# Altium project uSDRt.PrjPcb
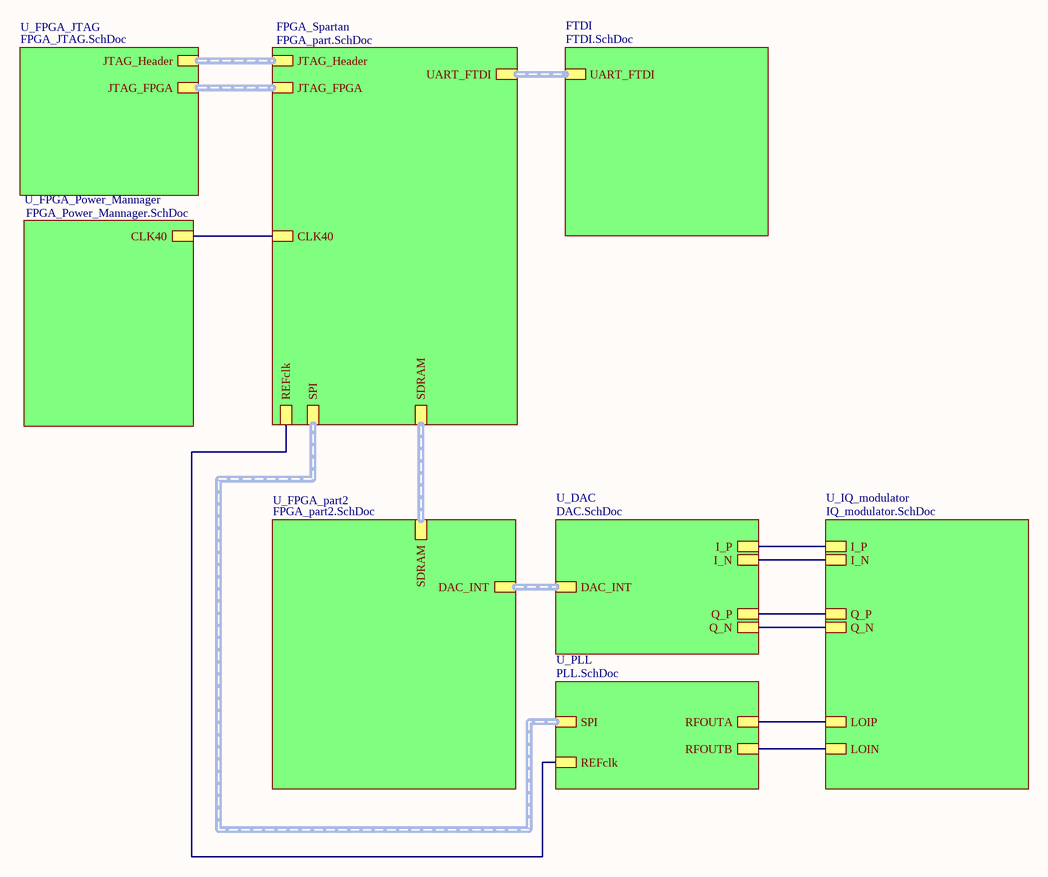
[diagram p0: TOP.SchDoc]
9 sheets, 232 parts. Net scope: hierarchical (ports join the sheet entries above them; power ports are global).
Sheets:
  TOP.SchDoc
    FPGA_Spartan = FPGA_part.SchDoc
    U_FPGA_Power_Mannager = FPGA_Power_Mannager.SchDoc
    U_FPGA_JTAG = FPGA_JTAG.SchDoc
    FTDI = FTDI.SchDoc
    U_FPGA_part2 = FPGA_part2.SchDoc
    U_DAC = DAC.SchDoc
    U_PLL = PLL.SchDoc
    U_IQ_modulator = IQ_modulator.SchDoc

## Sheet TOP.SchDoc
size A4

### Sub-sheets
FPGA_Spartan = FPGA_part.SchDoc: JTAG_FPGA (harness JTAG_FPGA), JTAG_Header (harness JTAG_Header), CLK40, UART_FTDI (harness UART), SDRAM (harness SDRAM), REFclk, SPI (harness SPI)
FTDI = FTDI.SchDoc: UART_FTDI (harness UART)
U_DAC = DAC.SchDoc: DAC_INT (harness DAC), I_P, I_N, Q_P, Q_N
U_FPGA_JTAG = FPGA_JTAG.SchDoc: JTAG_FPGA (harness JTAG_FPGA), JTAG_Header (harness JTAG_Header)
U_FPGA_part2 = FPGA_part2.SchDoc: DAC_INT (harness DAC), SDRAM (harness SDRAM)
U_FPGA_Power_Mannager = FPGA_Power_Mannager.SchDoc: CLK40
U_IQ_modulator = IQ_modulator.SchDoc: Q_N, Q_P, I_N, I_P, LOIP, LOIN
U_PLL = PLL.SchDoc: SPI (harness SPI), REFclk, RFOUTA, RFOUTB

### Nets
DAC_I_N: sheet U_DAC/I_N, sheet U_IQ_modulator/I_N
DAC_I_P: sheet U_DAC/I_P, sheet U_IQ_modulator/I_P
DAC_Q_N: sheet U_DAC/Q_N, sheet U_IQ_modulator/Q_N
DAC_Q_P: sheet U_DAC/Q_P, sheet U_IQ_modulator/Q_P
PLL_N: sheet U_PLL/RFOUTB, sheet U_IQ_modulator/LOIN
PLL_P: sheet U_PLL/RFOUTA, sheet U_IQ_modulator/LOIP
NetC56_1: sheet FPGA_Spartan/REFclk, sheet U_PLL/REFclk
NetR6_2: sheet FPGA_Spartan/CLK40, sheet U_FPGA_Power_Mannager/CLK40

### Buses and harness runs
harness sheet FPGA_Spartan/JTAG_FPGA = sheet U_FPGA_JTAG/JTAG_FPGA
harness sheet FPGA_Spartan/JTAG_Header = sheet U_FPGA_JTAG/JTAG_Header
harness sheet FPGA_Spartan/SDRAM = sheet U_FPGA_part2/SDRAM
harness sheet FPGA_Spartan/SPI = sheet U_PLL/SPI
harness sheet FPGA_Spartan/UART_FTDI = sheet FTDI/UART_FTDI
harness sheet U_DAC/DAC_INT = sheet U_FPGA_part2/DAC_INT

## Sheet FPGA_part.SchDoc
size A4
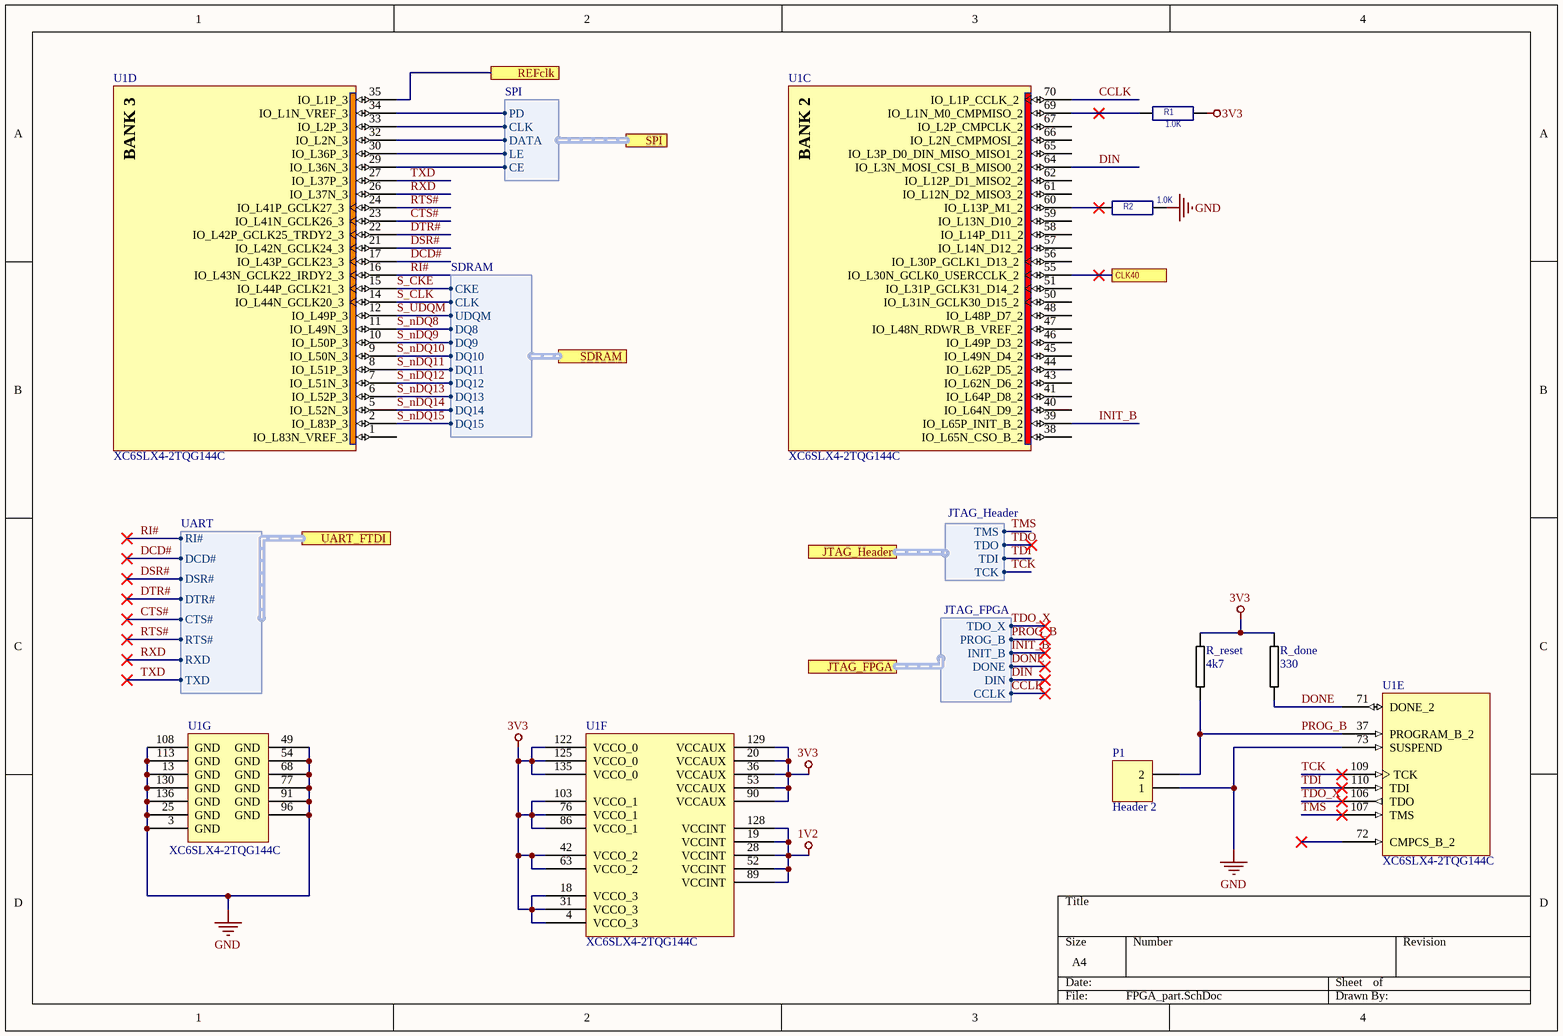
[diagram p1: FPGA_part.SchDoc]

### Parts
P1  Header 2  [HDR1X2]
R1  1.0K  [R0603]
R2  1.0K  [R0603]
R_done  330  [0603R-TBD]
R_reset  4k7  [0603R-TBD]
U1  XC6SLX4-2TQG144C  [TQG144_L]  (parts C,D,E,F,G of 7)

### Ports
CLK40, JTAG_FPGA (harness JTAG_FPGA), JTAG_Header (harness JTAG_Header), REFclk, SDRAM (harness SDRAM), SPI (harness SPI), UART_FTDI (harness UART)

### Harnesses
JTAG_Header: TCK, TDI, TDO, TMS
JTAG_FPGA: CCLK, DIN, DONE, INIT_B, PROG_B, TDO_X
UART: TXD, RXD, RTS#, CTS#, DTR#, DSR#, DCD#, RI#
SDRAM: CKE, CLK, DQ10, DQ11, DQ12, DQ13, DQ14, DQ15, DQ8, DQ9, UDQM
SPI: CE, CLK, DATA, LE, PD

### Nets
1V2: U1.19(VCCINT) U1.28(VCCINT) U1.52(VCCINT) U1.89(VCCINT) U1.128(VCCINT)
3V3: R1.2 R_done.1 R_reset.1 U1.4(VCCO_3) U1.18(VCCO_3) U1.20(VCCAUX) U1.31(VCCO_3) U1.36(VCCAUX) U1.42(VCCO_2) U1.53(VCCAUX) U1.63(VCCO_2) U1.76(VCCO_1) U1.86(VCCO_1) U1.90(VCCAUX) U1.103(VCCO_1) U1.122(VCCO_0) U1.125(VCCO_0) U1.129(VCCAUX) U1.135(VCCO_0)
GND: P1.1 R2.2 U1.3(GND) U1.13(GND) U1.25(GND) U1.49(GND) U1.54(GND) U1.68(GND) U1.73(SUSPEND) U1.77(GND) U1.91(GND) U1.96(GND) U1.108(GND) U1.113(GND) U1.130(GND) U1.136(GND)
CCLK: U1.70(IO_L1P_CCLK_2) ; port JTAG_FPGA.CCLK
CTS#: U1.23(IO_L41N_GCLK26_3) ; port UART_FTDI.CTS#
DCD#: U1.17(IO_L43P_GCLK23_3) ; port UART_FTDI.DCD#
DIN: U1.64(IO_L3N_MOSI_CSI_B_MISO0_2) ; port JTAG_FPGA.DIN
DONE: R_done.2 U1.71(DONE_2) ; port JTAG_FPGA.DONE
DSR#: U1.21(IO_L42N_GCLK24_3) ; port UART_FTDI.DSR#
DTR#: U1.22(IO_L42P_GCLK25_TRDY2_3) ; port UART_FTDI.DTR#
INIT_B: U1.39(IO_L65P_INIT_B_2) ; port JTAG_FPGA.INIT_B
PLL_ce: U1.29(IO_L36N_3) ; port SPI.CE
PLL_clk: U1.33(IO_L2P_3) ; port SPI.CLK
PLL_data: U1.32(IO_L2N_3) ; port SPI.DATA
PLL_le: U1.30(IO_L36P_3) ; port SPI.LE
PLL_pd: U1.34(IO_L1N_VREF_3) ; port SPI.PD
PROG_B: P1.2 R_reset.2 U1.37(PROGRAM_B_2) ; port JTAG_FPGA.PROG_B
RI#: U1.16(IO_L43N_GCLK22_IRDY2_3) ; port UART_FTDI.RI#
RTS#: U1.24(IO_L41P_GCLK27_3) ; port UART_FTDI.RTS#
RXD: U1.26(IO_L37N_3) ; port UART_FTDI.RXD
S_CKE: U1.15(IO_L44P_GCLK21_3) ; port SDRAM.CKE
S_CLK: U1.14(IO_L44N_GCLK20_3) ; port SDRAM.CLK
S_nDQ8: U1.11(IO_L49N_3) ; port SDRAM.DQ8
S_nDQ9: U1.10(IO_L50P_3) ; port SDRAM.DQ9
S_nDQ10: U1.9(IO_L50N_3) ; port SDRAM.DQ10
S_nDQ11: U1.8(IO_L51P_3) ; port SDRAM.DQ11
S_nDQ12: U1.7(IO_L51N_3) ; port SDRAM.DQ12
S_nDQ13: U1.6(IO_L52P_3) ; port SDRAM.DQ13
S_nDQ14: U1.5(IO_L52N_3) ; port SDRAM.DQ14
S_nDQ15: U1.2(IO_L83P_3) ; port SDRAM.DQ15
S_UDQM: U1.12(IO_L49P_3) ; port SDRAM.UDQM
TCK: U1.109(TCK) ; port JTAG_Header.TCK
TDI: U1.110(TDI) ; port JTAG_Header.TDI
TDO_X: U1.106(TDO) ; port JTAG_FPGA.TDO_X
TMS: U1.107(TMS) ; port JTAG_Header.TMS
TXD: U1.27(IO_L37P_3) ; port UART_FTDI.TXD
NetC56_1: U1.35(IO_L1P_3) ; port REFclk
NetR1_1: R1.1 U1.69(IO_L1N_M0_CMPMISO_2)
NetR2_1: R2.1 U1.60(IO_L13P_M1_2)
NetR6_2: U1.55(IO_L30N_GCLK0_USERCCLK_2) ; port CLK40

Not connected (* = marked no-connect by the designer): U1 1(IO_L83N_VREF_3) 38(IO_L65N_CSO_B_2) 40(IO_L64N_D9_2) 41(IO_L64P_D8_2) 43(IO_L62N_D6_2) 44(IO_L62P_D5_2) 45(IO_L49N_D4_2) 46(IO_L49P_D3_2) 47(IO_L48N_RDWR_B_VREF_2) 48(IO_L48P_D7_2) 50(IO_L31N_GCLK30_D15_2) 51(IO_L31P_GCLK31_D14_2) 56(IO_L30P_GCLK1_D13_2) 57(IO_L14N_D12_2) 58(IO_L14P_D11_2) 59(IO_L13N_D10_2) 61(IO_L12N_D2_MISO3_2) 62(IO_L12P_D1_MISO2_2) 65(IO_L3P_D0_DIN_MISO_MISO1_2) 66(IO_L2N_CMPMOSI_2) 67(IO_L2P_CMPCLK_2) 72(CMPCS_B_2)*

### Notes on the sheet
- (in symbol XC6SLX4-2TQG144C, part C) BANK 2
- (in symbol XC6SLX4-2TQG144C, part D) BANK 3

### Library data of the parts
P1 = Header 2: Header, 2-Pin; LatestRevisionDate: 17-Jul-2002; LatestRevisionNote: Re-released for DXP Platform.; Publisher: Altium Limited
R1 R2 = 1.0K_0603_0.063W_5%: 923-3385    RESISTOR MF_0603_1.0KR_0.063W_5%_50V; 232270260102; PHYCOMP; RoHS=Yes
R_done R_reset = 0603R-TBD: RESISTOR 0603 VALUE TO BE DETERMINED
U1 = XC6SLX4-2TQG144C: Spartan-6 LX 1.2V FPGA, 102 User I/Os, 144-Pin TQFP (0.5mm Pitch), Speed Grade 2, Commercial Grade, Pb-Free; Published: 1-Jul-2010; DatasheetVersion: ver1.6, Nov-2010; PackageVersion: ver1.2, Jun-2004; PackageReference: TQG144; Publisher: Altium Limited; PackageDescription: 144-Pin Thin Quad Flat Pack (TQG144) - Pb-Free; Supplier 1: Digi-Key; Supplier Part Number 1: XC6SLX4-2TQG144C-ND; Code_JEDEC: MS-026-BFB; ComponentLink1Description: Manufacturer Link; ComponentLink1URL: http://www.xilinx.com; ComponentLink2Description: Spartan-6 Datasheet; ComponentLink2URL: http://www.xilinx.com/support/documentation/data_sheets/ds160.pdf; ComponentLink3Description: Spartan-6 Documents; ComponentLink3URL: http://www.xilinx.com/support/documentation/spartan-6.htm; ComponentLink4Description: Xilinx.com Home; ComponentLink4URL: http://www.xilinx.com

## Sheet FPGA_Power_Mannager.SchDoc
size A4
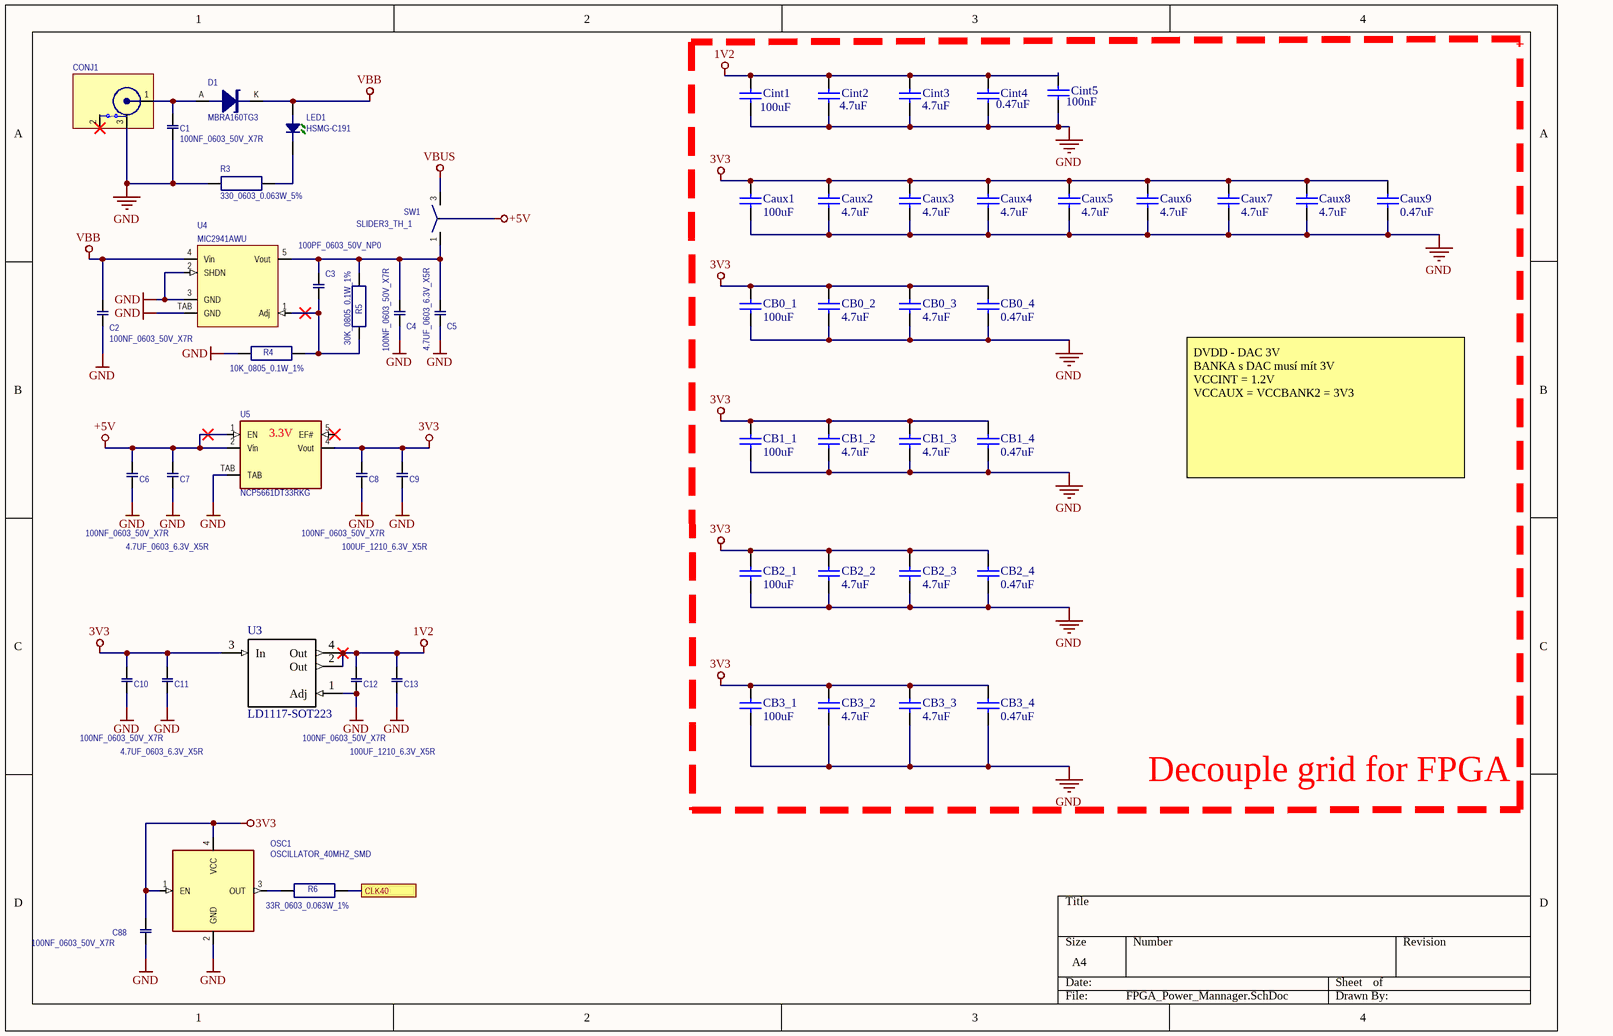
[diagram p2: FPGA_Power_Mannager.SchDoc]

### Parts
C1  100NF_0603_50V_X7R  [CAP0603]
C2  100NF_0603_50V_X7R  [CAP0603]
C3  100PF_0603_50V_NP0  [CAP0603]
C4  100NF_0603_50V_X7R  [CAP0603]
C5  4.7UF_0603_6.3V_X5R  [CAP0603]
C6  100NF_0603_50V_X7R  [CAP0603]
C7  4.7UF_0603_6.3V_X5R  [CAP0603]
C8  100NF_0603_50V_X7R  [CAP0603]
C9  100UF_1210_6.3V_X5R  [CAP1210]
C10  100NF_0603_50V_X7R  [CAP0603]
C11  4.7UF_0603_6.3V_X5R  [CAP0603]
C12  100NF_0603_50V_X7R  [CAP0603]
C13  100UF_1210_6.3V_X5R  [CAP1210]
C88  100NF_0603_50V_X7R  [CAP0603]
Caux1  100UF  [C1206]
Caux2  4.7UF  [1608[0603]]
Caux3  4.7UF  [1608[0603]]
Caux4  4.7UF  [1608[0603]]
Caux5  4.7UF  [1608[0603]]
Caux6  4.7UF  [1608[0603]]
Caux7  4.7UF  [1608[0603]]
Caux8  4.7UF  [1608[0603]]
Caux9  value 0.47uF  [1608[0603]]  (hidden comment: 470nF)
CB0_1  100UF  [C1206]
CB0_2  4.7UF  [1608[0603]]
CB0_3  4.7UF  [1608[0603]]
CB0_4  value 0.47uF  [1608[0603]]  (hidden comment: 470nF)
CB1_1  100UF  [C1206]
CB1_2  4.7UF  [1608[0603]]
CB1_3  4.7UF  [1608[0603]]
CB1_4  value 0.47uF  [1608[0603]]  (hidden comment: 470nF)
CB2_1  100UF  [C1206]
CB2_2  4.7UF  [1608[0603]]
CB2_3  4.7UF  [1608[0603]]
CB2_4  value 0.47uF  [1608[0603]]  (hidden comment: 470nF)
CB3_1  100UF  [C1206]
CB3_2  4.7UF  [1608[0603]]
CB3_3  4.7UF  [1608[0603]]
CB3_4  value 0.47uF  [1608[0603]]  (hidden comment: 470nF)
Cint1  100UF  [C1206]
Cint2  4.7UF  [1608[0603]]
Cint3  4.7UF  [1608[0603]]
Cint4  value 0.47uF  [1608[0603]]  (hidden comment: 470nF)
Cint5  100nF  [1608[0603]]
CONJ1  CON_POWER_DC10A_CLIFF  [CON_POWER_DC10A_CLIFF]  (value not drawn)
D1  MBRA160TG3  [SMA_KA]
LED1  HSMG-C191  [D0603]
OSC1  OSCILLATOR_40MHZ_SMD  [CFPS-73]
R3  330_0603_0.063W_5%  [R0603]
R4  10K_0805_0.1W_1%  [R0805]
R5  30K_0805_0.1W_1%  [R0805]
R6  33R_0603_0.063W_1%  [R0603]
SW1  SLIDER3_TH_1  [X3APH-SLIDER]
U3  LD1117-SOT223  [SOT223]
U4  MIC2941AWU  [TO263_5]
U5  NCP5661DT33RKG  [DPAK5]

### Ports
CLK40

### Nets
1V2: C12.1 C13.1 Cint1.2 Cint2.2 Cint3.2 Cint4.2 Cint5.2 U3.2(Out) U3.4(Out)
3V3: C8.1 C9.1 C10.1 C11.1 C88.2 Caux1.2 Caux2.2 Caux3.2 Caux4.2 Caux5.2 Caux6.2 Caux7.2 Caux8.2 Caux9.2 CB0_1.2 CB0_2.2 CB0_3.2 CB0_4.2 CB1_1.2 CB1_2.2 CB1_3.2 CB1_4.2 CB2_1.2 CB2_2.2 CB2_3.2 CB2_4.2 CB3_1.2 CB3_2.2 CB3_3.2 CB3_4.2 OSC1.1(EN) OSC1.4(VCC) U3.3(In) U5.4(Vout)
+5V: C6.1 C7.1 SW1.2 U5.1(EN) U5.2(Vin)
GND: C1.1 C2.1 C4.2 C5.2 C6.2 C7.2 C8.2 C9.2 C10.2 C11.2 C12.2 C13.2 C88.1 Caux1.1 Caux2.1 Caux3.1 Caux4.1 Caux5.1 Caux6.1 Caux7.1 Caux8.1 Caux9.1 CB0_1.1 CB0_2.1 CB0_3.1 CB0_4.1 CB1_1.1 CB1_2.1 CB1_3.1 CB1_4.1 CB2_1.1 CB2_2.1 CB2_3.1 CB2_4.1 CB3_1.1 CB3_2.1 CB3_3.1 CB3_4.1 Cint1.1 Cint2.1 Cint3.1 Cint4.1 Cint5.1 CONJ1.3 OSC1.2(GND) R3.1 R4.1 U3.1(Adj) U4.2(SHDN) U4.3(GND) U4.TAB(GND) U5.TAB
VBB: C2.2 D1.K(CATHODE) LED1.A U4.4(Vin)
VBUS: SW1.3
NetC1_2: C1.2 CONJ1.1 D1.A(ANODE)
NetC3_1: C3.1 R4.2 R5.2 U4.1(Adj)
NetC3_2: C3.2 C4.1 C5.1 R5.1 SW1.1 U4.5(Vout)
NetLED1_K: LED1.K R3.2
NetOSC1_3: OSC1.3(OUT) R6.1
NetR6_2: R6.2 ; port CLK40

Not connected (* = marked no-connect by the designer): CONJ1 2*; U5 5(EF#)*

### Notes on the sheet
- DVDD - DAC 3V
  BANKA s DAC musí mít 3V
  VCCINT = 1.2V
  VCCAUX = VCCBANK2 = 3V3
- Decouple grid for FPGA
- (in symbol NCP5661DT33RKG) 3.3V

### Library data of the parts
C1 C2 C4 C6 C8 C10 C12 C88 = 100NF_0603_50V_X7R: 128-8255    Capacitor MLC-X7R_0603_100NF_10%_50V; C0603C104K5RAC; KEMET; RoHS=Yes
C3 = 100PF_0603_50V_NP0: 141-4603    Capacitor MLC-NPO_0603_100PF_5%_50V; C0603C101J5GAC; KEMET; RoHS=Yes
C5 C7 C11 = 4.7UF_0603_6.3V_X5R: 940-2110    Capacitor MLC-X5R_0603_4.7uF_10%_6.3V; 225520613672; PHYCOMP; RoHS=Yes
C9 C13 = 100UF_1210_6.3V_X5R: 182-8817    Capacitor CML 100uF_1210_6.3V_X5R_20%; GRM32ER60J107ME20L; MURATA; RoHS=Yes
Caux1-Caux9 CB0_1-CB0_4 CB1_1-CB1_4 CB2_1-CB2_4 CB3_1-CB3_4 Cint1-Cint5 = Cap Semi: Capacitor (Semiconductor SIM Model); Published: 8-Jun-2000; LatestRevisionDate: 29-May-2009; LatestRevisionNote: IPC-7351 Footprint Added.; PackageReference: C1206; Publisher: Altium Limited; PackageDescription: Chip Capacitor
  Caux1 CB0_1 CB1_1 CB2_1 CB3_1 Cint1: Value: 100uF
  Caux2-Caux8 CB0_2 CB0_3 CB1_2 CB1_3 CB2_2 CB2_3 CB3_2 CB3_3 Cint2 Cint3: Value: 4.7uF
  Cint5: Value: 100nF
CONJ1 = CON_POWER_DC10A_CLIFF: 224-959+224-923    (PK10+PK10) SOCKET, PCB, DC POWER, 2.1MM, 5A, 12V; DC10A+DCPP1; CLIFF ELECTRONIC COMPONENTS; RoHS=Yes
D1 = MBRA160TG3: 143-1076    DIODE SCHOTTKY 60V/1A; MBRA160TG3; SMA; ONSEMI; RoHS=Yes; *: *
LED1 = HSMG-C191: 855-4617    LED DIODE GREEN 20mA, 0603; HSMG-C191; AVAGO TECHNOLOGIES; RoHS=Yes
OSC1 = OSCILLATOR_40MHZ_SMD: 522-2564US  CRYSTAL OSCILLATOR, SMD 40MHz/3.3V/50ppm; SPXO018042-CFPS-73; CFPS-73; IQD FREQUENCY PRODUCTS; RoHS=Yes
R3 = 1.0K_0603_0.063W_5%: as R1 on sheet FPGA_part
R4 = 10K_0805_0.1W_1%: 933-2391    RESISTOR MF_0805_10K_0.1W_1%_100V; MC 0.1W 0805 1% 10K; MULTICOMP; RoHS=Yes (repl. for 911-975)
R5 = 30K_0805_0.1W_1%: 933-3002    RESISTOR MF_0805_30K_0.1W_1%_100V; MC 0.1W 0805 1% 30K; MULTICOMP; RoHS=Yes (repl. for 321-8235)
R6 = 33R_0603_0.063W_1%: 933-1050    RESISTOR MF_0603_33R_0.063W_1%_50V; MC_0.063W_0603_1%_33R; MULTICOMP; RoHS=Yes
SW1 = SLIDER3_TH_1: 674-345     SWITCH SLIDE SPDT VERT; 09-03290-01; EAO; RoHS=Yes
U4 = MIC2941AWU: 155-6739    VOLTAGE REGULATOR, ADJ/1,5A, MIC2941AWU; MICREL; RoHS=Yes
U5 = NCP5661DT33RKG: ONSEMI      VOLTAGE REGULATOR NCP5661DT33RKG, LINEAR, LDO, 3.3V/1A, DPAK5; ONSEMI; RoHS=Yes

## Sheet FPGA_JTAG.SchDoc
size A4
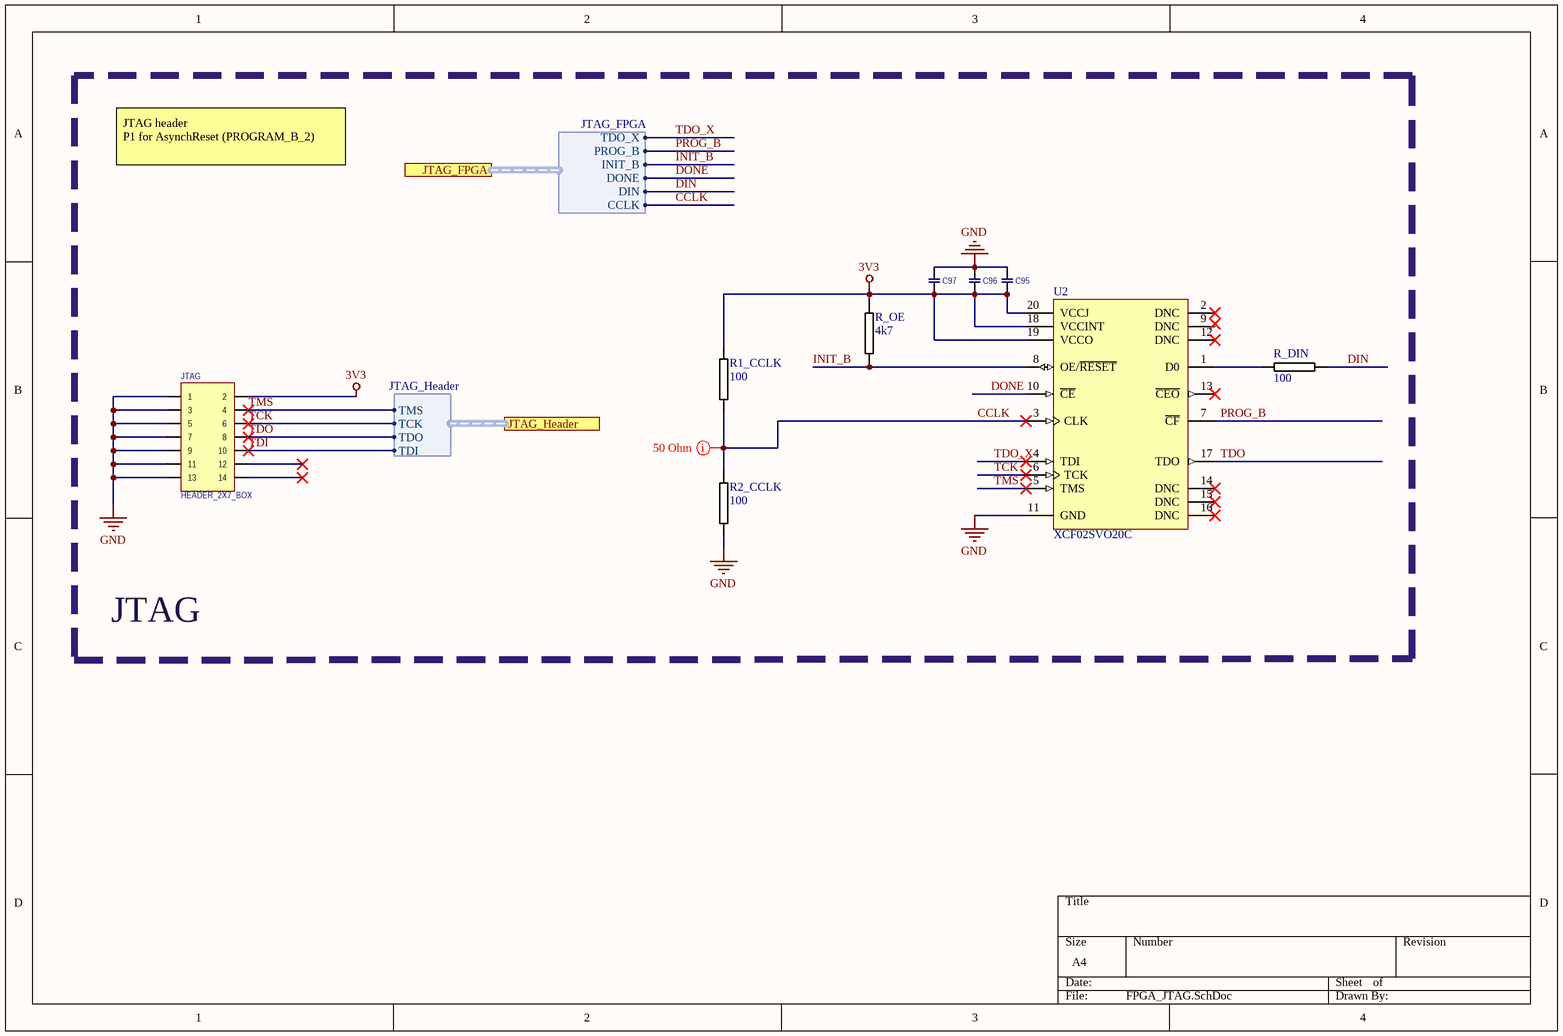
[diagram p3: FPGA_JTAG.SchDoc]

### Parts
C95  100NF_0603_50V_X7R  [CAP0603]  (value not drawn)
C96  470NF_0603_50V_X7R  [CAP0603]  (value not drawn)
C97  1UF_0603_50V_X7R  [CAP0603]  (value not drawn)
JTAG  HEADER_2X7_BOX  [X14ABPB]
R1_CCLK  100  [0603R-TBD]
R2_CCLK  100  [0603R-TBD]
R_DIN  100  [0603R-TBD]
R_OE  4k7  [0603R-TBD]
U2  XCF02SVO20C  [VO20_N]

### Blocks framed on the sheet
JTAG: C95-C97 JTAG R1_CCLK R2_CCLK R_DIN R_OE U2

### Ports
JTAG_FPGA (harness JTAG_FPGA), JTAG_Header (harness JTAG_Header)

### Harnesses
JTAG_FPGA: CCLK, DIN, DONE, INIT_B, PROG_B, TDO_X
JTAG_Header: TCK, TDI, TDO, TMS

### Nets
3V3: C95.2 C96.2 C97.2 JTAG.2 R1_CCLK.1 R_OE.1 U2.18(VCCINT) U2.19(VCCO) U2.20(VCCJ)
GND: C95.1 C96.1 C97.1 JTAG.1 JTAG.3 JTAG.5 JTAG.7 JTAG.9 JTAG.11 JTAG.13 R2_CCLK.2 U2.11(GND)
CCLK: R1_CCLK.2 R2_CCLK.1 U2.3(CLK) ; port JTAG_FPGA.CCLK
DIN: R_DIN.2 ; port JTAG_FPGA.DIN
DONE: U2.10(~{CE}) ; port JTAG_FPGA.DONE
INIT_B: R_OE.2 U2.8(OE/~{RESET}) ; port JTAG_FPGA.INIT_B
PROG_B: U2.7(~{CF}) ; port JTAG_FPGA.PROG_B
TCK: JTAG.6 U2.6(TCK) ; port JTAG_Header.TCK
TDI: JTAG.10 ; port JTAG_Header.TDI
TDO: JTAG.8 U2.17(TDO) ; port JTAG_Header.TDO
TDO_X: U2.4(TDI) ; port JTAG_FPGA.TDO_X
TMS: JTAG.4 U2.5(TMS) ; port JTAG_Header.TMS
NetR_DIN_1: R_DIN.1 U2.1(D0)

Not connected (* = marked no-connect by the designer): JTAG 12* 14*; U2 2(DNC)* 9(DNC) 12(DNC)* 13(~{CEO})* 14(DNC)* 15(DNC)* 16(DNC)*

### Layout directives
mark named 50 Ohm: CCLK

### Notes on the sheet
- JTAG header
  P1 for AsynchReset (PROGRAM_B_2)

### Library data of the parts
C95-C97 = 100NF_0603_50V_X7R: as C1 on sheet FPGA_Power_Mannager
JTAG = HEADER_2X7_BOX: 636-344    STRAIGHT HEADER, DOUBLE ROW OF 7 PINS EACH, BOX, GOLD PLATED, 2.54MM PITCH, 1MM HOLE (match 636-046 SOCKET); 008380014000010; ELCO; RoHS=Yes (alt. 381-6266, 109-9256)
R1_CCLK R2_CCLK R_DIN R_OE = 0603R-TBD: RESISTOR 0603 VALUE TO BE DETERMINED
U2 = XCF02SVO20C: XCF00S Series, Platform Flash In-System Programmable Configuration 3.3V PROM, 20-Pin TSOP, 2-Megabit, Commercial Grade; Published: 17-Sep-2003; LatestRevisionDate: 16-Nov-2009; LatestRevisionNote: Updated to datasheet version 2.17, Oct-2009.; DatasheetVersion: ver2.17, Oct-2009; PackageVersion: ver1.3, Dec-2008; PackageReference: VO20; Publisher: Altium Limited; PackageDescription: 20-Pin Thin Shrink Small Outline Package (VO20); Supplier 1: Digi-Key; Supplier Part Number 1: XCF02SVO20C-ND; Code_JEDEC: MO-153-AC; ComponentLink1Description: Platform Flash Datasheet; ComponentLink1URL: http://www.xilinx.com/support/documentation/data_sheets/ds123.pdf; ComponentLink2Description: VO20 Package Drawing; ComponentLink2URL: http://www.xilinx.com/support/documentation/package_specs/vo20.pdf; ComponentLink3Description: Configuration PROM Documents; ComponentLink3URL: http://www.xilinx.com/support/documentation/configuration_proms.htm; ComponentLink4Description: Xilinx.com Home; ComponentLink4URL: http://www.xilinx.com

## Sheet FTDI.SchDoc
size A4
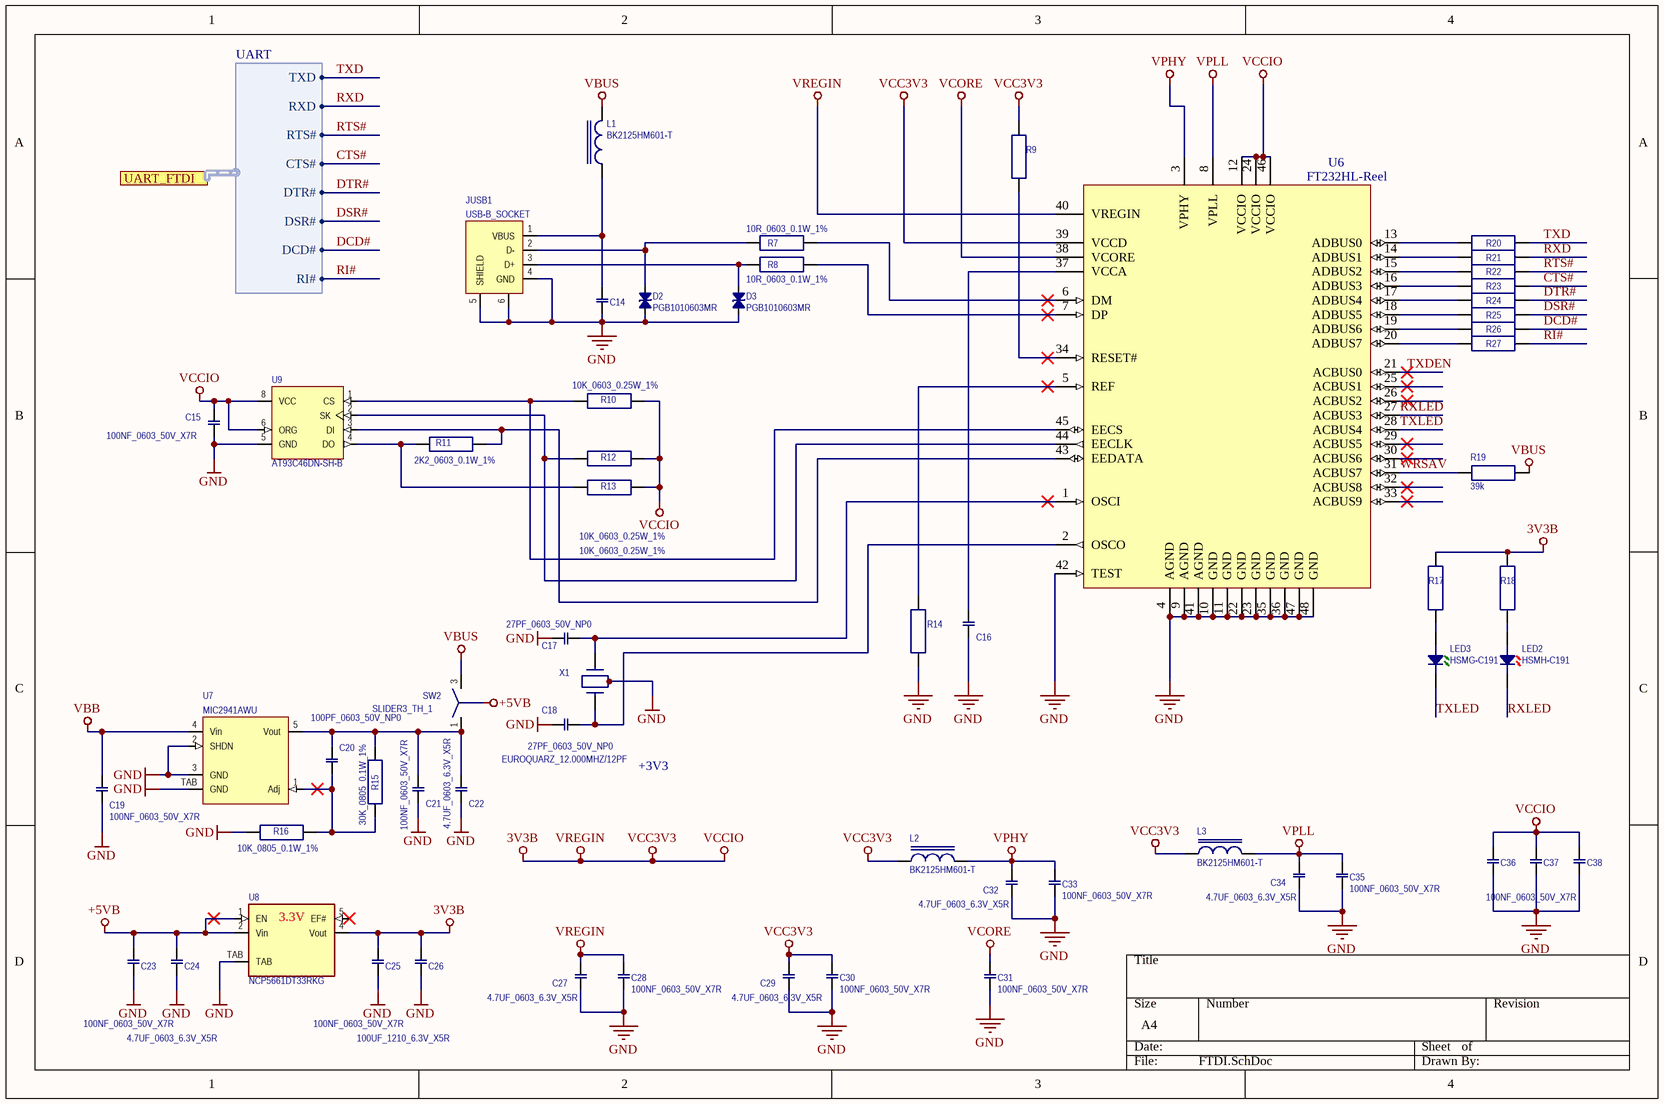
[diagram p4: FTDI.SchDoc]

### Parts
C14  10NF_0603_50V_X7R  [CAP0603]  (value not drawn)
C15  100NF_0603_50V_X7R  [CAP0603]
C16  100NF_0603_50V_X7R  [CAP0603]  (value not drawn)
C17  27PF_0603_50V_NP0  [CAP0603]
C18  27PF_0603_50V_NP0  [CAP0603]
C19  100NF_0603_50V_X7R  [CAP0603]
C20  100PF_0603_50V_NP0  [CAP0603]
C21  100NF_0603_50V_X7R  [CAP0603]
C22  4.7UF_0603_6.3V_X5R  [CAP0603]
C23  100NF_0603_50V_X7R  [CAP0603]
C24  4.7UF_0603_6.3V_X5R  [CAP0603]
C25  100NF_0603_50V_X7R  [CAP0603]
C26  100UF_1210_6.3V_X5R  [CAP1210]
C27  4.7UF_0603_6.3V_X5R  [CAP0603]
C28  100NF_0603_50V_X7R  [CAP0603]
C29  4.7UF_0603_6.3V_X5R  [CAP0603]
C30  100NF_0603_50V_X7R  [CAP0603]
C31  100NF_0603_50V_X7R  [CAP0603]
C32  4.7UF_0603_6.3V_X5R  [CAP0603]
C33  100NF_0603_50V_X7R  [CAP0603]
C34  4.7UF_0603_6.3V_X5R  [CAP0603]
C35  100NF_0603_50V_X7R  [CAP0603]
C36  100NF_0603_50V_X7R  [CAP0603]  (value not drawn)
C37  100NF_0603_50V_X7R  [CAP0603]
C38  100NF_0603_50V_X7R  [CAP0603]  (value not drawn)
D2  PGB1010603MR  [0603]
D3  PGB1010603MR  [0603]
JUSB1  USB-B_SOCKET  [USB-B_SOCKET]
L1  BK2125HM601-T  [L0805]
L2  BK2125HM601-T  [L0805]
L3  BK2125HM601-T  [L0805]
LED2  HSMH-C191  [D0603]
LED3  HSMG-C191  [D0603]
R7  10R_0603_0.1W_1%  [R0603]
R8  10R_0603_0.1W_1%  [R0603]
R9  10K_0603_0.25W_1%  [R0603]  (value not drawn)
R10  10K_0603_0.25W_1%  [R0603]
R11  2K2_0603_0.1W_1%  [R0603]
R12  10K_0603_0.25W_1%  [R0603]
R13  10K_0603_0.25W_1%  [R0603]
R14  12K_0603_0.25W_1%  [R0603]  (value not drawn)
R15  30K_0805_0.1W_1%  [R0805]
R16  10K_0805_0.1W_1%  [R0805]
R17  47R_0603_0.1W_1%  [R0603]  (value not drawn)
R18  62R_0603_0.1W_1%  [R0603]  (value not drawn)
R19  39k  [R0603]
R20  100R_0603_0.1W_1%  [R0603]  (value not drawn)
R21  100R_0603_0.1W_1%  [R0603]  (value not drawn)
R22  100R_0603_0.1W_1%  [R0603]  (value not drawn)
R23  100R_0603_0.1W_1%  [R0603]  (value not drawn)
R24  100R_0603_0.1W_1%  [R0603]  (value not drawn)
R25  100R_0603_0.1W_1%  [R0603]  (value not drawn)
R26  100R_0603_0.1W_1%  [R0603]  (value not drawn)
R27  100R_0603_0.1W_1%  [R0603]  (value not drawn)
SW2  SLIDER3_TH_1  [X3APH-SLIDER]
U6  FT232HL-Reel  [LQFP-48_N]
U7  MIC2941AWU  [TO263_5]
U8  NCP5661DT33RKG  [DPAK5]
U9  AT93C46DN-SH-B  [SOIC8]
X1  EUROQUARZ_12.000MHZ/12PF  [EUROQUARZ_3.2X5.0MM]

### Ports
UART_FTDI (harness UART)

### Harnesses
UART: TXD, RXD, RTS#, CTS#, DTR#, DSR#, DCD#, RI#

### Nets
3V3B: C15.1 C25.1 C26.1 C27.1 C28.1 C29.1 C30.1 C36.1 C37.1 C38.1 L2.1 L3.1 R9.2 R10.2 R12.2 R13.2 R17.2 R18.2 U6.12(VCCIO) U6.24(VCCIO) U6.39(VCCD) U6.40(VREGIN) U6.46(VCCIO) U8.4(Vout) U9.6(ORG) U9.8(VCC)  [also labelled VCC3V3, VCCIO, VREGIN]  [project net Vvco]
+5VB: C23.1 C24.1 SW2.2 U8.1(EN) U8.2(Vin)
GND: C14.2 C15.2 C16.2 C17.2 C18.2 C19.1 C21.2 C22.2 C23.2 C24.2 C25.2 C26.2 C27.2 C28.2 C29.2 C30.2 C31.2 C32.2 C33.2 C34.2 C35.2 C36.2 C37.2 C38.2 D2.1 D3.1 JUSB1.4(GND) JUSB1.5(SHIELD) JUSB1.6(SHIELD) R14.1 R16.1 U6.4(AGND) U6.9(AGND) U6.10(GND) U6.11(GND) U6.22(GND) U6.23(GND) U6.35(GND) U6.36(GND) U6.41(AGND) U6.42(TEST) U6.47(GND) U6.48(GND) U7.2(SHDN) U7.3(GND) U7.TAB(GND) U8.TAB U9.5(GND) X1.2 X1.4  [also labelled SHIELD]
VBB: C19.2 U7.4(Vin)
VBUS: L1.2 R19.2 SW2.3
VCORE: C31.1 U6.38(VCORE)
VPHY: C32.1 C33.1 L2.2 U6.3(VPHY)
VPLL: C34.1 C35.1 L3.2 U6.8(VPLL)
CTS#: R23.2 ; port UART_FTDI.CTS#
DCD#: R26.2 ; port UART_FTDI.DCD#
DSR#: R25.2 ; port UART_FTDI.DSR#
DTR#: R24.2 ; port UART_FTDI.DTR#
RI#: R27.2 ; port UART_FTDI.RI#
RTS#: R22.2 ; port UART_FTDI.RTS#
RXD: R21.2 ; port UART_FTDI.RXD
RXLED: LED2.K U6.27(ACBUS3)
TXD: R20.2 ; port UART_FTDI.TXD
TXDEN: U6.21(ACBUS0)
TXLED: LED3.K U6.28(ACBUS4)
WRSAV: R19.1 U6.31(ACBUS7)
NetC14_1: C14.1 JUSB1.1(VBUS) L1.1
NetC16_1: C16.1 U6.37(VCCA)
NetC17_1: C17.1 U6.1(OSCI) X1.3
NetC18_1: C18.1 U6.2(OSCO) X1.1
NetC20_1: C20.1 R15.2 R16.2 U7.1(Adj)
NetC20_2: C20.2 C21.1 C22.1 R15.1 SW2.1 U7.5(Vout)
NetD2_2: D2.2 JUSB1.2(D-) R7.1
NetD3_2: D3.2 JUSB1.3(D+) R8.1
NetLED2_A: LED2.A R18.1
NetLED3_A: LED3.A R17.1
NetR7_2: R7.2 U6.6(DM)
NetR8_2: R8.2 U6.7(DP)
NetR9_1: R9.1 U6.34(RESET#)
NetR10_1: R10.1 U6.45(EECS) U9.1(CS)
NetR11_1: R11.1 R13.1 U9.4(DO)
NetR11_2: R11.2 U6.43(EEDATA) U9.3(DI)
NetR12_1: R12.1 U6.44(EECLK) U9.2(SK)
NetR14_2: R14.2 U6.5(REF)
NetR20_1: R20.1 U6.13(ADBUS0)
NetR21_1: R21.1 U6.14(ADBUS1)
NetR22_1: R22.1 U6.15(ADBUS2)
NetR23_1: R23.1 U6.16(ADBUS3)
NetR24_1: R24.1 U6.17(ADBUS4)
NetR25_1: R25.1 U6.18(ADBUS5)
NetR26_1: R26.1 U6.19(ADBUS6)
NetR27_1: R27.1 U6.20(ADBUS7)

Not connected (* = marked no-connect by the designer): U6 25(ACBUS1)* 26(ACBUS2)* 29(ACBUS5)* 30(ACBUS6)* 32(ACBUS8)* 33(ACBUS9)*; U8 5(EF#)*

### Notes on the sheet
- +3V3
- (in symbol NCP5661DT33RKG) 3.3V

### Library data of the parts
C14-C16 C19 C21 C23 C25 C28 C30 C31 C33 C35-C38 = 100NF_0603_50V_X7R: as C1 on sheet FPGA_Power_Mannager
C17 C18 = 27PF_0603_50V_NP0: 141-4627    Capacitor MLC-NPO_0603_27PF_5%_50V; C0603C270J5GAC; KEMET; RoHS=Yes
C20 = 100PF_0603_50V_NP0: as C3 on sheet FPGA_Power_Mannager
C22 C24 C27 C29 C32 C34 = 4.7UF_0603_6.3V_X5R: as C5 on sheet FPGA_Power_Mannager
C26 = 100UF_1210_6.3V_X5R: as C9 on sheet FPGA_Power_Mannager
D2 D3 = PGB1010603MR: 175-7240   SUPPRESSOR, ESD, 15KV; PGB1010603MR; LITTELFUSE; RoHS=Yes
JUSB1 = USB-B_SOCKET: 117-7885    USB PANEL SOCKET PCB TYPE B; 2411 02; LUMBERG; RoHS=Yes
L1-L3 = BK2125HM601-T: 161-1995    FERRITE CHIP BEAD 500mA, 600Ohm@100MHz; BK2125HM601-T; TAIYO YUDEN; RoHS=Yes
LED2 = HSMH-C191: 855-4650    LED DIODE RED 25mA, 0603; HSMH-C191; AVAGO TECHNOLOGIES; RoHS=Yes
LED3 = HSMG-C191: as LED1 on sheet FPGA_Power_Mannager
R7 R8 R17 R18 = 10R_0603_0.1W_1%: 146-9751    RESISTOR MF_0603_10R_0.1W_1%_75V; CRCW060310R0FKEA; VISHAY; RoHS=Yes
R9 R10 R12 R13 = 10K_0603_0.25W_1%: 173-8918    RESISTOR MF_0603_10K_0.25W_1%; CRCW06010K0FKEAHP VISHAY; RoHS=Yes
R11 = 2K2_0603_0.1W_1%: 146-9765    RESISTOR MF_0603_2K2_0.1W_1%_75V; CRCW06032K20FKEA; VISHAY; RoHS=Yes
R14 = 12K_0603_0.25W_1%: 173-8919    RESISTOR MF_0603_12KR_0.25W_1%_75V; MC 0.250W 0603 1% 12K; CRCW060312K0FKEAHP VISHAY; RoHS=Yes
R15 = 30K_0805_0.1W_1%: as R5 on sheet FPGA_Power_Mannager
R16 = 10K_0805_0.1W_1%: as R4 on sheet FPGA_Power_Mannager
R19 = 0.0R_0603_0.063W_5%: 923-3130    RESISTOR MF_0603_0.0R_0.1W_50V; RC0603JR-070RL; YAGEO; RoHS=Yes
R20-R27 = 100R_0603_0.1W_1%: 146-9752    RESISTOR MF_0603_100R_0.1W_1%_75V; CRCW0603100RFKEA; VISHAY; RoHS=Yes
SW2 = SLIDER3_TH_1: as SW1 on sheet FPGA_Power_Mannager
U6 = FT232HL-Reel: Single Channel Hi-Speed USB to Multipurpose UART/FIFO IC, 48-pin LQFP, Tape and Reel; Manufacturer: FTDI; DatasheetVersion: ver 1.8, Dec-2012; PackageVersion: Dec-12; PackageReference: LQFP-48; PackageDescription: 48-Pin Thin Quad Flat Pack, 7 x 7 mm Body, 0.5 mm Pitch; PartNumber: FT232HL-Reel; ComponentLink1Description: Manufacturer URL; ComponentLink1URL: http://www.ftdichip.com/; ComponentLink2Description: Datasheet; ComponentLink2URL: http://www.ftdichip.com/Support/Documents/DataSheets/ICs/DS_FT232H.pdf
U7 = MIC2941AWU: as U4 on sheet FPGA_Power_Mannager
U8 = NCP5661DT33RKG: as U5 on sheet FPGA_Power_Mannager
U9 = AT93C46DN-SH-B: 145-5086    EEPROM 1kBit; AT93C46DN-SH-B; SOIC8; ATMEL; RoHS=Yes
X1 = EUROQUARZ_12.000MHZ/12PF: 164-0927    CRYSTAL, SMD, 12.000MHZ MJ/30/30/40/12PF; EUROQUARZ RoHS=Yes

## Sheet FPGA_part2.SchDoc
size A4
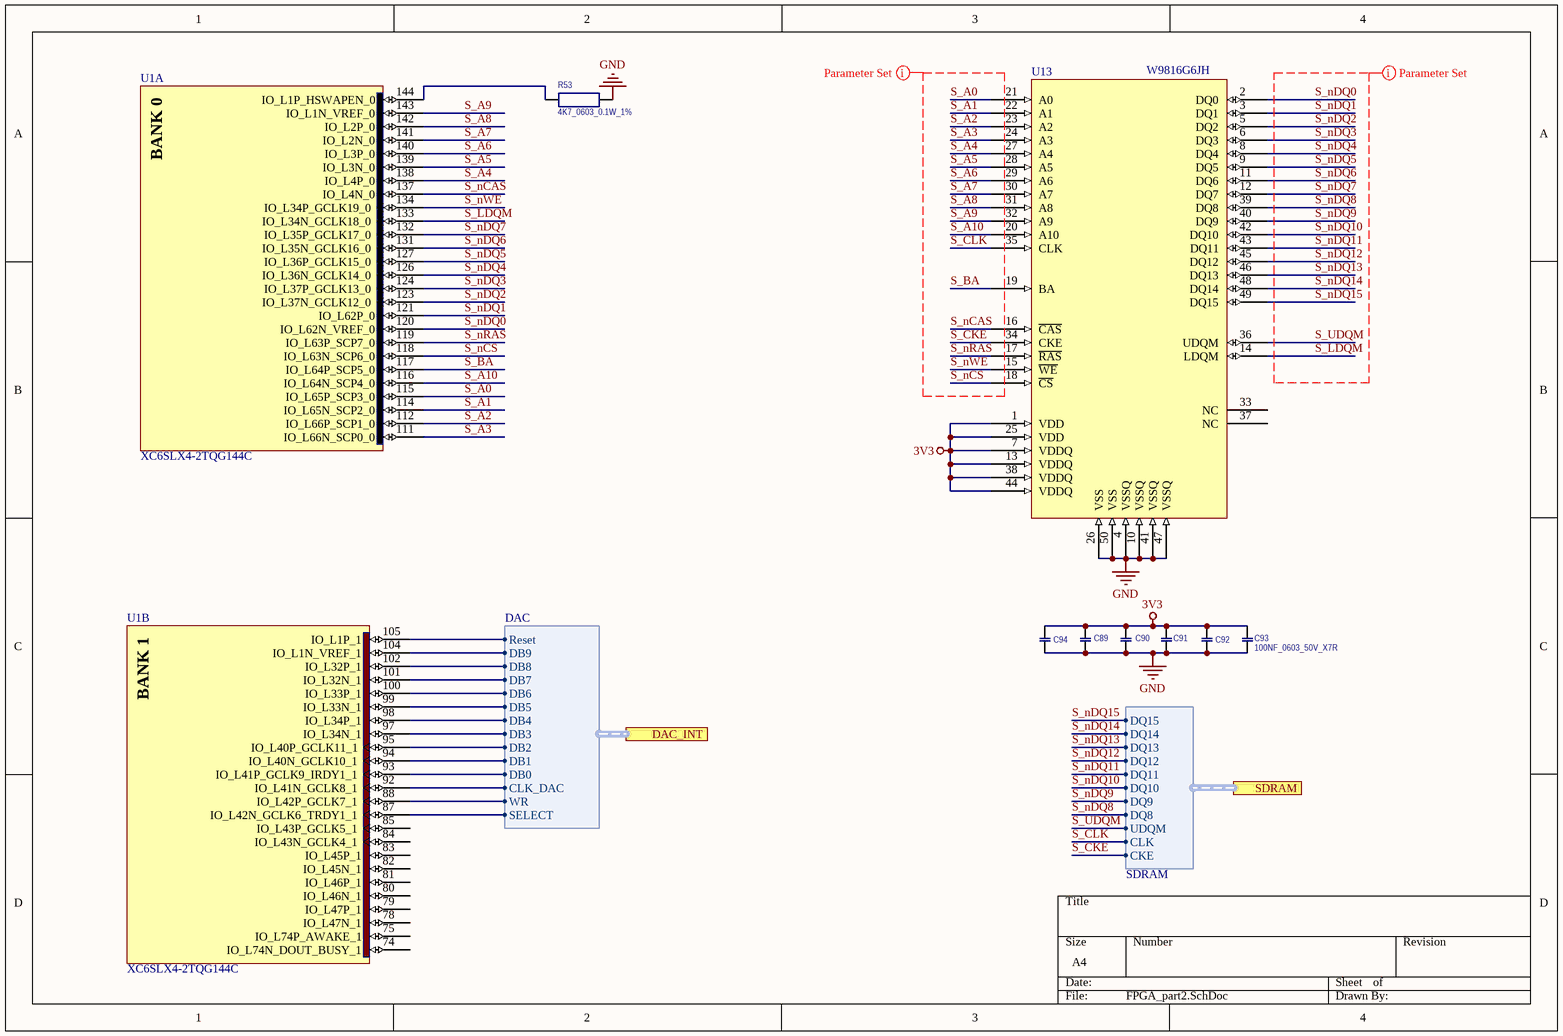
[diagram p5: FPGA_part2.SchDoc]

### Parts
C89  100NF_0603_50V_X7R  [CAP0603]  (value not drawn)
C90  100NF_0603_50V_X7R  [CAP0603]  (value not drawn)
C91  100NF_0603_50V_X7R  [CAP0603]  (value not drawn)
C92  100NF_0603_50V_X7R  [CAP0603]  (value not drawn)
C93  100NF_0603_50V_X7R  [CAP0603]
C94  100NF_0603_50V_X7R  [CAP0603]  (value not drawn)
R53  4K7_0603_0.1W_1%  [R0603]
U1  XC6SLX4-2TQG144C  [TQG144_L]  (parts A,B of 7)
U13  W9816G6JH  [SSOP50]

### Ports
DAC_INT (harness DAC), SDRAM (harness SDRAM)

### Harnesses
DAC: CLK_DAC, DB0, DB1, DB2, DB3, DB4, DB5, DB6, DB7, DB8, DB9, Reset, SELECT, WR
SDRAM: DQ15, DQ8, DQ9, DQ10, DQ11, DQ12, DQ13, DQ14, UDQM, CLK, CKE

### Nets
3V3: C89.1 C90.1 C91.1 C92.1 C93.1 C94.1 U13.1(VDD) U13.7(VDDQ) U13.13(VDDQ) U13.25(VDD) U13.38(VDDQ) U13.44(VDDQ)
GND: C89.2 C90.2 C91.2 C92.2 C93.2 C94.2 R53.2 U13.4(VSSQ) U13.10(VSSQ) U13.26(VSS) U13.41(VSSQ) U13.47(VSSQ) U13.50(VSS)
CLK_DAC: U1.92(IO_L41N_GCLK8_1) ; port DAC_INT.CLK_DAC
DB0: U1.93(IO_L41P_GCLK9_IRDY1_1) ; port DAC_INT.DB0
DB1: U1.94(IO_L40N_GCLK10_1) ; port DAC_INT.DB1
DB2: U1.95(IO_L40P_GCLK11_1) ; port DAC_INT.DB2
DB3: U1.97(IO_L34N_1) ; port DAC_INT.DB3
DB4: U1.98(IO_L34P_1) ; port DAC_INT.DB4
DB5: U1.99(IO_L33N_1) ; port DAC_INT.DB5
DB6: U1.100(IO_L33P_1) ; port DAC_INT.DB6
DB7: U1.101(IO_L32N_1) ; port DAC_INT.DB7
DB8: U1.102(IO_L32P_1) ; port DAC_INT.DB8
DB9: U1.104(IO_L1N_VREF_1) ; port DAC_INT.DB9
Reset/Sleep: U1.105(IO_L1P_1) ; port DAC_INT.Reset
S_A0: U1.115(IO_L65P_SCP3_0) U13.21(A0)
S_A1: U1.114(IO_L65N_SCP2_0) U13.22(A1)
S_A2: U1.112(IO_L66P_SCP1_0) U13.23(A2)
S_A3: U1.111(IO_L66N_SCP0_0) U13.24(A3)
S_A4: U1.138(IO_L4P_0) U13.27(A4)
S_A5: U1.139(IO_L3N_0) U13.28(A5)
S_A6: U1.140(IO_L3P_0) U13.29(A6)
S_A7: U1.141(IO_L2N_0) U13.30(A7)
S_A8: U1.142(IO_L2P_0) U13.31(A8)
S_A9: U1.143(IO_L1N_VREF_0) U13.32(A9)
S_A10: U1.116(IO_L64N_SCP4_0) U13.20(A10)
S_BA: U1.117(IO_L64P_SCP5_0) U13.19(BA)
S_CKE: U13.34(CKE) ; port SDRAM.CKE
S_CLK: U13.35(CLK) ; port SDRAM.CLK
S_LDQM: U1.133(IO_L34N_GCLK18_0) U13.14(LDQM)
S_nCAS: U1.137(IO_L4N_0) U13.16(~{CAS})
S_nCS: U1.118(IO_L63N_SCP6_0) U13.18(~{CS})
S_nDQ0: U1.120(IO_L62N_VREF_0) U13.2(DQ0)
S_nDQ1: U1.121(IO_L62P_0) U13.3(DQ1)
S_nDQ2: U1.123(IO_L37N_GCLK12_0) U13.5(DQ2)
S_nDQ3: U1.124(IO_L37P_GCLK13_0) U13.6(DQ3)
S_nDQ4: U1.126(IO_L36N_GCLK14_0) U13.8(DQ4)
S_nDQ5: U1.127(IO_L36P_GCLK15_0) U13.9(DQ5)
S_nDQ6: U1.131(IO_L35N_GCLK16_0) U13.11(DQ6)
S_nDQ7: U1.132(IO_L35P_GCLK17_0) U13.12(DQ7)
S_nDQ8: U13.39(DQ8) ; port SDRAM.DQ8
S_nDQ9: U13.40(DQ9) ; port SDRAM.DQ9
S_nDQ10: U13.42(DQ10) ; port SDRAM.DQ10
S_nDQ11: U13.43(DQ11) ; port SDRAM.DQ11
S_nDQ12: U13.45(DQ12) ; port SDRAM.DQ12
S_nDQ13: U13.46(DQ13) ; port SDRAM.DQ13
S_nDQ14: U13.48(DQ14) ; port SDRAM.DQ14
S_nDQ15: U13.49(DQ15) ; port SDRAM.DQ15
S_nRAS: U1.119(IO_L63P_SCP7_0) U13.17(~{RAS})
S_nWE: U1.134(IO_L34P_GCLK19_0) U13.15(~{WE})
S_UDQM: U13.36(UDQM) ; port SDRAM.UDQM
SELECT: U1.87(IO_L42N_GCLK6_TRDY1_1) ; port DAC_INT.SELECT
WR_DAC: U1.88(IO_L42P_GCLK7_1) ; port DAC_INT.WR
NetR53_1: R53.1 U1.144(IO_L1P_HSWAPEN_0)

Not connected (* = marked no-connect by the designer): U1 74(IO_L74N_DOUT_BUSY_1) 75(IO_L74P_AWAKE_1) 78(IO_L47N_1) 79(IO_L47P_1) 80(IO_L46N_1) 81(IO_L46P_1) 82(IO_L45N_1) 83(IO_L45P_1) 84(IO_L43N_GCLK4_1) 85(IO_L43P_GCLK5_1); U13 33(NC) 37(NC)

### Layout directives
net class SDRAM: S_A0, S_A1, S_A2, S_A3, S_A4, S_A5, S_A6, S_A7, S_A8, S_A9, S_A10, S_BA, S_CKE, S_CLK, S_LDQM, S_nCAS, S_nCS, S_nDQ0, S_nDQ1, S_nDQ2, S_nDQ3, S_nDQ4, S_nDQ5, S_nDQ6, S_nDQ7, S_nDQ8, S_nDQ9, S_nDQ10, S_nDQ11, S_nDQ12, S_nDQ13, S_nDQ14, S_nDQ15, S_nRAS, S_nWE, S_UDQM

### Notes on the sheet
- (in symbol XC6SLX4-2TQG144C, part A) BANK 0
- (in symbol XC6SLX4-2TQG144C, part B) BANK 1

### Library data of the parts
C89-C94 = 100NF_0603_50V_X7R: as C1 on sheet FPGA_Power_Mannager
R53 = 4K7_0603_0.1W_1%: 146-9807    RESISTOR MF_0603_4K7_0.1W_1%_75V; CRCW06034K70FKEA; VISHAY; RoHS=Yes
U1 = XC6SLX4-2TQG144C: as U1 on sheet FPGA_part; Published: 1-Jul-2010; DatasheetVersion: ver1.6, Nov-2010; PackageVersion: ver1.2, Jun-2004; PackageReference: TQG144; Publisher: Altium Limited; PackageDescription: 144-Pin Thin Quad Flat Pack (TQG144) - Pb-Free; Supplier 1: Digi-Key; Supplier Part Number 1: XC6SLX4-2TQG144C-ND; Code_JEDEC: MS-026-BFB; ComponentLink1Description: Manufacturer Link; ComponentLink1URL: http://www.xilinx.com; ComponentLink2Description: Spartan-6 Datasheet; ComponentLink2URL: http://www.xilinx.com/support/documentation/data_sheets/ds160.pdf; ComponentLink3Description: Spartan-6 Documents; ComponentLink3URL: http://www.xilinx.com/support/documentation/spartan-6.htm; ComponentLink4Description: Xilinx.com Home; ComponentLink4URL: http://www.xilinx.com

## Sheet DAC.SchDoc
size A4
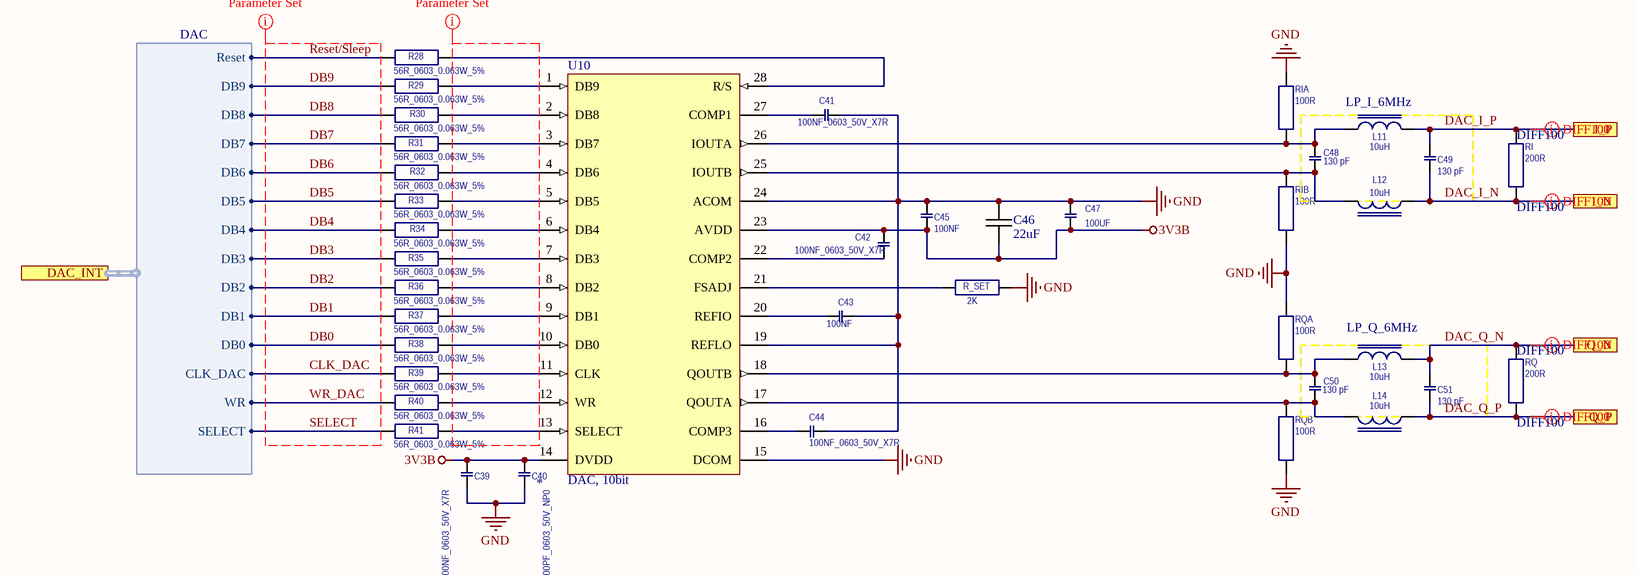
[diagram p6: DAC.SchDoc]

### Parts
C39  100NF_0603_50V_X7R  [CAP0603]
C40  100PF_0603_50V_NP0  [CAP0603]
C41  100NF_0603_50V_X7R  [CAP0603]
C42  100NF_0603_50V_X7R  [CAP0603]
C43  100NF  [CAP0603]
C44  100NF_0603_50V_X7R  [CAP0603]
C45  100NF  [CAP0603]
C46  22uF  [0805C-GENERIC]
C47  100UF  [CAP1210]
C48  130 pF  [CAP0603]
C49  130 pF  [CAP0603]
C50  130 pF  [CAP0603]
C51  130 pF  [CAP0603]
L11  10uH  [L0805]
L12  10uH  [L0805]
L13  10uH  [L0805]
L14  10uH  [L0805]
R28  56R_0603_0.063W_5%  [R0603]
R29  56R_0603_0.063W_5%  [R0603]
R30  56R_0603_0.063W_5%  [R0603]
R31  56R_0603_0.063W_5%  [R0603]
R32  56R_0603_0.063W_5%  [R0603]
R33  56R_0603_0.063W_5%  [R0603]
R34  56R_0603_0.063W_5%  [R0603]
R35  56R_0603_0.063W_5%  [R0603]
R36  56R_0603_0.063W_5%  [R0603]
R37  56R_0603_0.063W_5%  [R0603]
R38  56R_0603_0.063W_5%  [R0603]
R39  56R_0603_0.063W_5%  [R0603]
R40  56R_0603_0.063W_5%  [R0603]
R41  56R_0603_0.063W_5%  [R0603]
R_SET  2K  [R0603]
RI  200R  [R0603]
RIA  100R  [R0603]
RIB  100R  [R0603]
RQ  200R  [R0603]
RQA  100R  [R0603]
RQB  100R  [R0603]
U10  DAC, 10bit  [SSOP28]

### Blocks framed on the sheet
LP_I_6MHz: C48 C49 L11 L12
LP_Q_6MHz: C50 C51 L13 L14

### Ports
DAC_INT (harness DAC), I_N, I_P, Q_N, Q_P

### Harnesses
DAC: DB0, DB1, DB2, DB3, DB4, DB5, DB6, DB7, DB8, DB9, CLK_DAC, WR, SELECT, Reset

### Nets
3V3B: C39.1 C40.1 C42.2 C45.2 C46.2 C47.2 U10.14(DVDD) U10.23(AVDD)  [project net Vvco]
GND: C39.2 C40.2 C41.2 C43.2 C44.1 C45.1 C46.1 C47.1 R_SET.2 RIA.2 RIB.1 RQA.2 RQB.1 U10.15(DCOM) U10.19(REFLO) U10.24(ACOM)
CLK_DAC: R39.1 ; port DAC_INT.CLK_DAC
DAC_I_N: C49.2 L12.1 RI.1 ; port I_N
DAC_I_P: C49.1 L11.2 RI.2 ; port I_P
DAC_Q_N: C51.1 L13.2 RQ.2 ; port Q_N
DAC_Q_P: C51.2 L14.1 RQ.1 ; port Q_P
DB0: R38.1 ; port DAC_INT.DB0
DB1: R37.1 ; port DAC_INT.DB1
DB2: R36.1 ; port DAC_INT.DB2
DB3: R35.1 ; port DAC_INT.DB3
DB4: R34.1 ; port DAC_INT.DB4
DB5: R33.1 ; port DAC_INT.DB5
DB6: R32.1 ; port DAC_INT.DB6
DB7: R31.1 ; port DAC_INT.DB7
DB8: R30.1 ; port DAC_INT.DB8
DB9: R29.1 ; port DAC_INT.DB9
Reset/Sleep: R28.1 ; port DAC_INT.Reset
SELECT: R41.1 ; port DAC_INT.SELECT
WR_DAC: R40.1 ; port DAC_INT.WR
NetC41_1: C41.1 U10.27(COMP1)
NetC42_1: C42.1 U10.22(COMP2)
NetC43_1: C43.1 U10.20(REFIO)
NetC44_2: C44.2 U10.16(COMP3)
NetC48_1: C48.1 L11.1 RIA.1 U10.26(IOUTA)
NetC48_2: C48.2 L12.2 RIB.2 U10.25(IOUTB)
NetC50_1: C50.1 L13.1 RQA.1 U10.18(QOUTB)
NetC50_2: C50.2 L14.2 RQB.2 U10.17(QOUTA)
NetR28_2: R28.2 U10.28(R/S)
NetR29_2: R29.2 U10.1(DB9)
NetR30_2: R30.2 U10.2(DB8)
NetR31_2: R31.2 U10.3(DB7)
NetR32_2: R32.2 U10.4(DB6)
NetR33_2: R33.2 U10.5(DB5)
NetR34_2: R34.2 U10.6(DB4)
NetR35_2: R35.2 U10.7(DB3)
NetR36_2: R36.2 U10.8(DB2)
NetR37_2: R37.2 U10.9(DB1)
NetR38_2: R38.2 U10.10(DB0)
NetR39_2: R39.2 U10.11(CLK)
NetR40_2: R40.2 U10.12(WR)
NetR41_2: R41.2 U10.13(SELECT)
NetR_SET_1: R_SET.1 U10.21(FSADJ)

### Layout directives
net class DAC_BR: CLK_DAC, DB0, DB1, DB2, DB3, DB4, DB5, DB6, DB7, DB8, DB9, Reset/Sleep, SELECT, WR_DAC
net class DAC_AR: (no net found under the mark)
differential pair; net class DIFF100: DAC_I_N, DAC_I_P, DAC_Q_N, DAC_Q_P

### Library data of the parts
C39 C41-C45 C48-C51 = 100NF_0603_50V_X7R: as C1 on sheet FPGA_Power_Mannager
C40 = 100PF_0603_50V_NP0: as C3 on sheet FPGA_Power_Mannager
C46 = 0805C-22UF-6V3-X5R-TDK: CAPACITOR 0805 CERAMIC; Manufacturer: TDK Corporation; Manufacturer Part Number: C2012X5R0J226M; Tolerance: ±20%; Capacitance: 22µF; Temperature Coefficient: X5R; Voltage - Rated: 6.3V; Supplier 1: Digi-Key; Supplier Part Number 1: 445-1422-2-ND; Operating Temperature: -55°C ~ 85°C; Mounting Type: Surface Mount, MLCC; RoHS: RoHS Compliant; Packaging: Tape & Reel (TR); Features: General Purpose; Lead Spacing: -; Category: Capacitors; Thickness: 1.25mm; Package / Case: 0805 (2012 Metric); Supplier Part Number: 445-1422-2-ND; Supplier: Digi-Key
C47 = 100UF_1210_6.3V_X5R: as C9 on sheet FPGA_Power_Mannager
L11-L14 = BK2125HM601-T: as L1 on sheet FTDI
R28-R41 = 0.0R_0603_0.063W_5%: as R19 on sheet FTDI
R_SET = 2K2_0603_0.1W_1%: as R11 on sheet FTDI
RI RQ = 100R_0603_0.1W_1%: as R20 on sheet FTDI
RIA RIB RQA RQB = 1.0K_0603_0.063W_5%: as R1 on sheet FPGA_part
U10 = AD9761: Parameter 1: *

## Sheet PLL.SchDoc
size A4
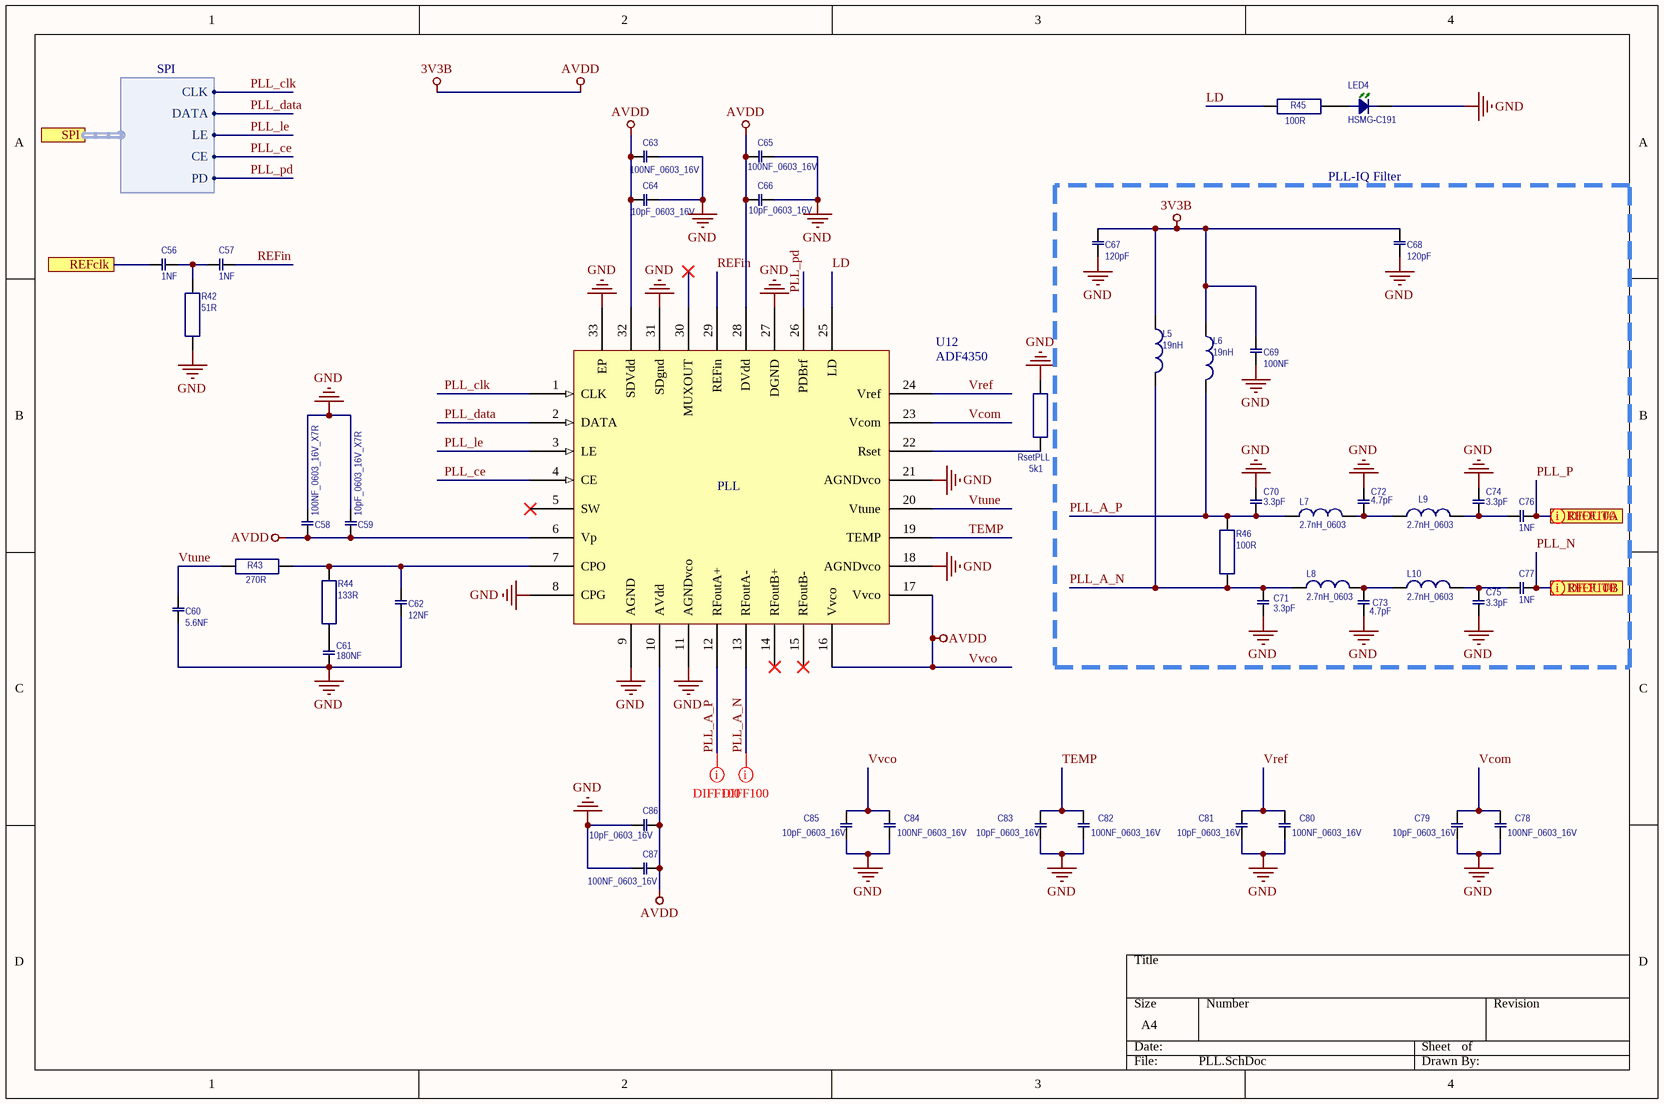
[diagram p7: PLL.SchDoc]

### Parts
C56  1NF  [CAP0603]
C57  1NF  [CAP0603]
C58  100NF_0603_16V_X7R  [CAP0603]
C59  10pF_0603_16V_X7R  [CAP0603]
C60  5.6NF  [CAP0603]
C61  180NF  [CAP0603]
C62  12NF  [CAP0603]
C63  100NF_0603_16V  [CAP0603]
C64  10pF_0603_16V  [CAP0603]
C65  100NF_0603_16V  [CAP0603]
C66  10pF_0603_16V  [CAP0603]
C67  120pF  [CAP0603]
C68  120pF  [CAP0603]
C69  100NF  [CAP0603]
C70  3.3pF  [CAP0603]
C71  3.3pF  [CAP0603]
C72  4.7pF  [CAP0603]
C73  4.7pF  [CAP0603]
C74  3.3pF  [CAP0603]
C75  3.3pF  [CAP0603]
C76  1NF  [CAP0603]
C77  1NF  [CAP0603]
C78  100NF_0603_16V  [CAP0603]
C79  10pF_0603_16V  [CAP0603]
C80  100NF_0603_16V  [CAP0603]
C81  10pF_0603_16V  [CAP0603]
C82  100NF_0603_16V  [CAP0603]
C83  10pF_0603_16V  [CAP0603]
C84  100NF_0603_16V  [CAP0603]
C85  10pF_0603_16V  [CAP0603]
C86  10pF_0603_16V  [CAP0603]
C87  100NF_0603_16V  [CAP0603]
L5  19nH  [0603]
L6  19nH  [0603]
L7  2.7nH_0603  [0603]
L8  2.7nH_0603  [0603]
L9  2.7nH_0603  [0603]
L10  2.7nH_0603  [0603]
LED4  HSMG-C191  [D0603]
R42  51R  [R0603]
R43  270R  [R0603]
R44  133R  [R0603]
R45  100R  [R0603]
R46  100R  [R0603]
RsetPLL  5k1  [R0603]
U12  ADF4350  [LFCSP8]

### Blocks framed on the sheet
PLL-IQ Filter: C67-C77 L5-L10 R46

### Ports
REFclk, RFOUTA, RFOUTB, SPI (harness SPI)

### Harnesses
SPI: CLK, DATA, LE, CE, PD

### Nets
GND: C58.2 C59.2 C60.2 C61.2 C62.2 C63.2 C64.2 C65.2 C66.2 C67.2 C68.2 C69.2 C70.1 C71.2 C72.1 C73.2 C74.1 C75.2 C78.2 C79.2 C80.2 C81.2 C82.2 C83.2 C84.2 C85.2 C86.2 C87.2 LED4.K R42.1 RsetPLL.1 U12.8(CPG) U12.9(AGND) U12.11(AGNDvco) U12.18(AGNDvco) U12.21(AGNDvco) U12.27(DGND) U12.31(SDgnd) U12.33(EP)
Vvco: C58.1 C59.1 C63.1 C64.1 C65.1 C66.1 C67.1 C68.1 C69.1 C84.1 C85.1 C86.1 C87.1 L5.1 L6.1 U12.6(Vp) U12.10(AVdd) U12.16(Vvco) U12.17(Vvco) U12.28(DVdd) U12.32(SDVdd)  [also labelled 3V3B, AVDD]
LD: R45.1 U12.25(LD)
PLL_A_N: C71.1 L5.2 L8.1 R46.1 U12.13(RFoutA-)
PLL_A_P: C70.2 L6.2 L7.1 R46.2 U12.12(RFoutA+)
PLL_ce: U12.4(CE) ; port SPI.CE
PLL_clk: U12.1(CLK) ; port SPI.CLK
PLL_data: U12.2(DATA) ; port SPI.DATA
PLL_le: U12.3(LE) ; port SPI.LE
PLL_N: C77.2 ; port RFOUTB
PLL_P: C76.2 ; port RFOUTA
PLL_pd: U12.26(PDBrf) ; port SPI.PD
REFin: C57.2 U12.29(REFin)
TEMP: C82.1 C83.1 U12.19(TEMP)
Vcom: C78.1 C79.1 U12.23(Vcom)
Vref: C80.1 C81.1 U12.24(Vref)
Vtune: C60.1 R43.2 U12.20(Vtune)
NetC56_1: C56.1 ; port REFclk
NetC56_2: C56.2 C57.1 R42.2
NetC61_1: C61.1 R44.1
NetC62_1: C62.1 R43.1 R44.2 U12.7(CPO)
NetC72_2: C72.2 L7.2 L9.1
NetC73_1: C73.1 L8.2 L10.1
NetC74_2: C74.2 C76.1 L9.2
NetC75_1: C75.1 C77.1 L10.2
NetLED4_A: LED4.A R45.2
NetRsetPLL_2: RsetPLL.2 U12.22(Rset)

Not connected (* = marked no-connect by the designer): U12 5(SW)* 14(RFoutB+)* 15(RFoutB-)* 30(MUXOUT)*

### Layout directives
differential pair; net class DIFF_PLL: PLL_A_N, PLL_A_P, PLL_N, PLL_P

### Notes on the sheet
- (in symbol ADF4150) PLL

### Library data of the parts
C56-C66 C69 C76-C87 = 100NF_0603_50V_X7R: as C1 on sheet FPGA_Power_Mannager
C67 C68 C70-C75 = 100PF_0603_50V_NP0: as C3 on sheet FPGA_Power_Mannager
L5-L10 = Inductor0603
LED4 = HSMG-C191: as LED1 on sheet FPGA_Power_Mannager
R42 = 120R_0603_0.1W_1%: 165-2832    RESISTOR MF_0603_120R_0.1W_1%_75V; CRCW0603120RFKEA; VISHAY; RoHS=Yes
R43 R44 R46 = 100R_0603_0.1W_1%: as R20 on sheet FTDI
R45 = 0.0R_0603_0.063W_5%: as R19 on sheet FTDI
RsetPLL = 4K7_0603_0.1W_1%: as R53 on sheet FPGA_part2
U12 = ADF4150

## Sheet IQ_modulator.SchDoc
size A4
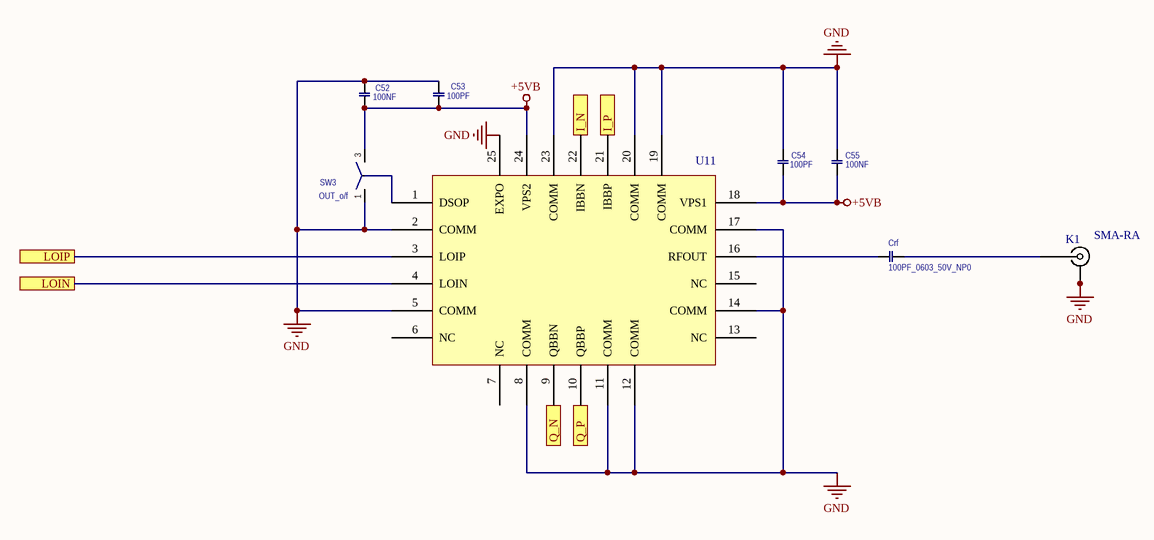
[diagram p8: IQ_modulator.SchDoc]

### Parts
C52  100NF  [CAP0603]
C53  100PF  [CAP0603]
C54  100PF  [CAP0603]
C55  100NF  [CAP0603]
Crf  100PF_0603_50V_NP0  [CAP0603]
K1  SMA-RA  [SMA-RA]
SW3  OUT_o/f  [X3APH-SLIDER]
U11  ADL5375  [LFCSP]  (value not drawn)

### Ports
I_N, I_P, LOIN, LOIP, Q_N, Q_P

### Nets
+5VB: C52.2 C53.2 C54.2 C55.2 SW3.3 U11.18(VPS1) U11.24(VPS2)
GND: C52.1 C53.1 C54.1 C55.1 K1.2 K1.3 K1.4 K1.5 SW3.1 U11.2(COMM) U11.5(COMM) U11.8(COMM) U11.11(COMM) U11.12(COMM) U11.14(COMM) U11.17(COMM) U11.19(COMM) U11.20(COMM) U11.23(COMM) U11.25(EXPO)
DAC_I_N: U11.22(IBBN) ; port I_N
DAC_I_P: U11.21(IBBP) ; port I_P
DAC_Q_N: U11.9(QBBN) ; port Q_N
DAC_Q_P: U11.10(QBBP) ; port Q_P
PLL_N: U11.4(LOIN) ; port LOIN
PLL_P: U11.3(LOIP) ; port LOIP
NetCrf_1: Crf.1 U11.16(RFOUT)
NetCrf_2: Crf.2 K1.1
NetSW3_2: SW3.2 U11.1(DSOP)

Not connected (* = marked no-connect by the designer): U11 6(NC) 7(NC) 13(NC) 15(NC)

### Library data of the parts
C52 C55 = 100NF_0603_50V_X7R: as C1 on sheet FPGA_Power_Mannager
C53 C54 Crf = 100PF_0603_50V_NP0: as C3 on sheet FPGA_Power_Mannager
K1 = SMA-RA: SMA THREADED RF CONNECTOR VERTICAL
SW3 = SLIDER3_TH_1: as SW1 on sheet FPGA_Power_Mannager

## Nets that join several sheets
1V2: FPGA_part (5 pins), FPGA_Power_Mannager (9 pins)
3V3: FPGA_part (19 pins), FPGA_Power_Mannager (34 pins), FPGA_JTAG (9 pins), FPGA_part2 (12 pins)
+5VB: FTDI (5 pins), IQ_modulator (7 pins)
GND: FPGA_part (16 pins), FPGA_Power_Mannager (52 pins), FPGA_JTAG (12 pins), FTDI (50 pins), FPGA_part2 (13 pins), DAC (16 pins), PLL (39 pins), IQ_modulator (20 pins)
VBB: FPGA_Power_Mannager (C2.2 D1.K LED1.A U4.4), FTDI (C19.2 U7.4)
VBUS: FPGA_Power_Mannager (SW1.3), FTDI (L1.2 R19.2 SW2.3)
Vvco: FTDI (26 pins), DAC (8 pins), PLL (21 pins)
CCLK: FPGA_part (U1.70), FPGA_JTAG (R1_CCLK.2 R2_CCLK.1 U2.3)
CLK_DAC: FPGA_part2 (U1.92), DAC (R39.1)
CTS#: FPGA_part (U1.23), FTDI (R23.2)
DAC_I_N: DAC (C49.2 L12.1 RI.1), IQ_modulator (U11.22)
DAC_I_P: DAC (C49.1 L11.2 RI.2), IQ_modulator (U11.21)
DAC_Q_N: DAC (C51.1 L13.2 RQ.2), IQ_modulator (U11.9)
DAC_Q_P: DAC (C51.2 L14.1 RQ.1), IQ_modulator (U11.10)
DB0: FPGA_part2 (U1.93), DAC (R38.1)
DB1: FPGA_part2 (U1.94), DAC (R37.1)
DB2: FPGA_part2 (U1.95), DAC (R36.1)
DB3: FPGA_part2 (U1.97), DAC (R35.1)
DB4: FPGA_part2 (U1.98), DAC (R34.1)
DB5: FPGA_part2 (U1.99), DAC (R33.1)
DB6: FPGA_part2 (U1.100), DAC (R32.1)
DB7: FPGA_part2 (U1.101), DAC (R31.1)
DB8: FPGA_part2 (U1.102), DAC (R30.1)
DB9: FPGA_part2 (U1.104), DAC (R29.1)
DCD#: FPGA_part (U1.17), FTDI (R26.2)
DIN: FPGA_part (U1.64), FPGA_JTAG (R_DIN.2)
DONE: FPGA_part (R_done.2 U1.71), FPGA_JTAG (U2.10)
DSR#: FPGA_part (U1.21), FTDI (R25.2)
DTR#: FPGA_part (U1.22), FTDI (R24.2)
INIT_B: FPGA_part (U1.39), FPGA_JTAG (R_OE.2 U2.8)
NetC56_1: FPGA_part (U1.35), PLL (C56.1)
NetR6_2: FPGA_part (U1.55), FPGA_Power_Mannager (R6.2)
PLL_ce: FPGA_part (U1.29), PLL (U12.4)
PLL_clk: FPGA_part (U1.33), PLL (U12.1)
PLL_data: FPGA_part (U1.32), PLL (U12.2)
PLL_le: FPGA_part (U1.30), PLL (U12.3)
PLL_N: PLL (C77.2), IQ_modulator (U11.4)
PLL_P: PLL (C76.2), IQ_modulator (U11.3)
PLL_pd: FPGA_part (U1.34), PLL (U12.26)
PROG_B: FPGA_part (P1.2 R_reset.2 U1.37), FPGA_JTAG (U2.7)
Reset/Sleep: FPGA_part2 (U1.105), DAC (R28.1)
RI#: FPGA_part (U1.16), FTDI (R27.2)
RTS#: FPGA_part (U1.24), FTDI (R22.2)
RXD: FPGA_part (U1.26), FTDI (R21.2)
S_CKE: FPGA_part (U1.15), FPGA_part2 (U13.34)
S_CLK: FPGA_part (U1.14), FPGA_part2 (U13.35)
S_nDQ8: FPGA_part (U1.11), FPGA_part2 (U13.39)
S_nDQ9: FPGA_part (U1.10), FPGA_part2 (U13.40)
S_nDQ10: FPGA_part (U1.9), FPGA_part2 (U13.42)
S_nDQ11: FPGA_part (U1.8), FPGA_part2 (U13.43)
S_nDQ12: FPGA_part (U1.7), FPGA_part2 (U13.45)
S_nDQ13: FPGA_part (U1.6), FPGA_part2 (U13.46)
S_nDQ14: FPGA_part (U1.5), FPGA_part2 (U13.48)
S_nDQ15: FPGA_part (U1.2), FPGA_part2 (U13.49)
S_UDQM: FPGA_part (U1.12), FPGA_part2 (U13.36)
SELECT: FPGA_part2 (U1.87), DAC (R41.1)
TCK: FPGA_part (U1.109), FPGA_JTAG (JTAG.6 U2.6)
TDI: FPGA_part (U1.110), FPGA_JTAG (JTAG.10)
TDO_X: FPGA_part (U1.106), FPGA_JTAG (U2.4)
TMS: FPGA_part (U1.107), FPGA_JTAG (JTAG.4 U2.5)
TXD: FPGA_part (U1.27), FTDI (R20.2)
WR_DAC: FPGA_part2 (U1.88), DAC (R40.1)